# Altium project PCB_Eng_Model_OBDH_2.PrjPcb
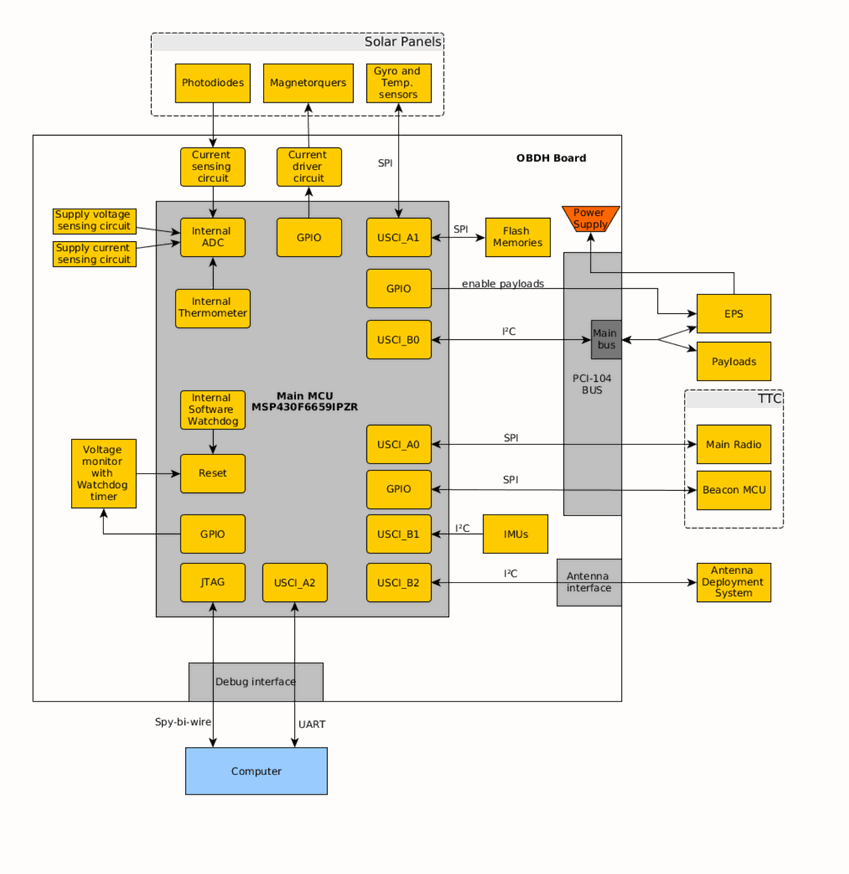
[diagram p0: 0_Architecture.SchDoc]
8 sheets, 189 parts. Net scope: hierarchical (ports join the sheet entries above them; power ports are global).
Board file: PCB_OBDH.PcbDoc
Sheets:
  0_Architecture.SchDoc
  1_Interface.SchDoc
    Designator = 2_Topology.SchDoc
      MCU_OBDH = 3_MCU_Main.SchDoc
      Current Sensing = 7_Current_Sensing.SchDoc
      Non Volatile Memory = 5_Non_Volatile_Memory.SchDoc
      Magnetorquer Drivers = 6_Magnetorquer_Drivers.SchDoc
      IMU = 4_IMU.SchDoc

## Sheet 0_Architecture.SchDoc: OBDH Hardware Archictecture
size A4; DrawnBy: Sara V. Martinez; Engineer: Flight; Revision: V0.0; SheetNumber: 0; SheetTotal: 7

### Notes on the sheet
- Title
- Size:
- Date:
- A4
- Project:
- Time:
- FloripaSat
- Revision:
- Sheet
- of
- UFSC - SpaceLab
- University Campus - Trindade
- Dep. of Electrical Engineering - CTC
- Florianópolis, Santa Catarina, Brazil
- Drawn By:
- Model:
- CEP: 88040 - 900

## Sheet 1_Interface.SchDoc: OBDH Interface
size A3; DrawnBy: Sara V. Martinez; Engineer: Flight; Revision: V0.0; SheetNumber: 1; SheetTotal: 7
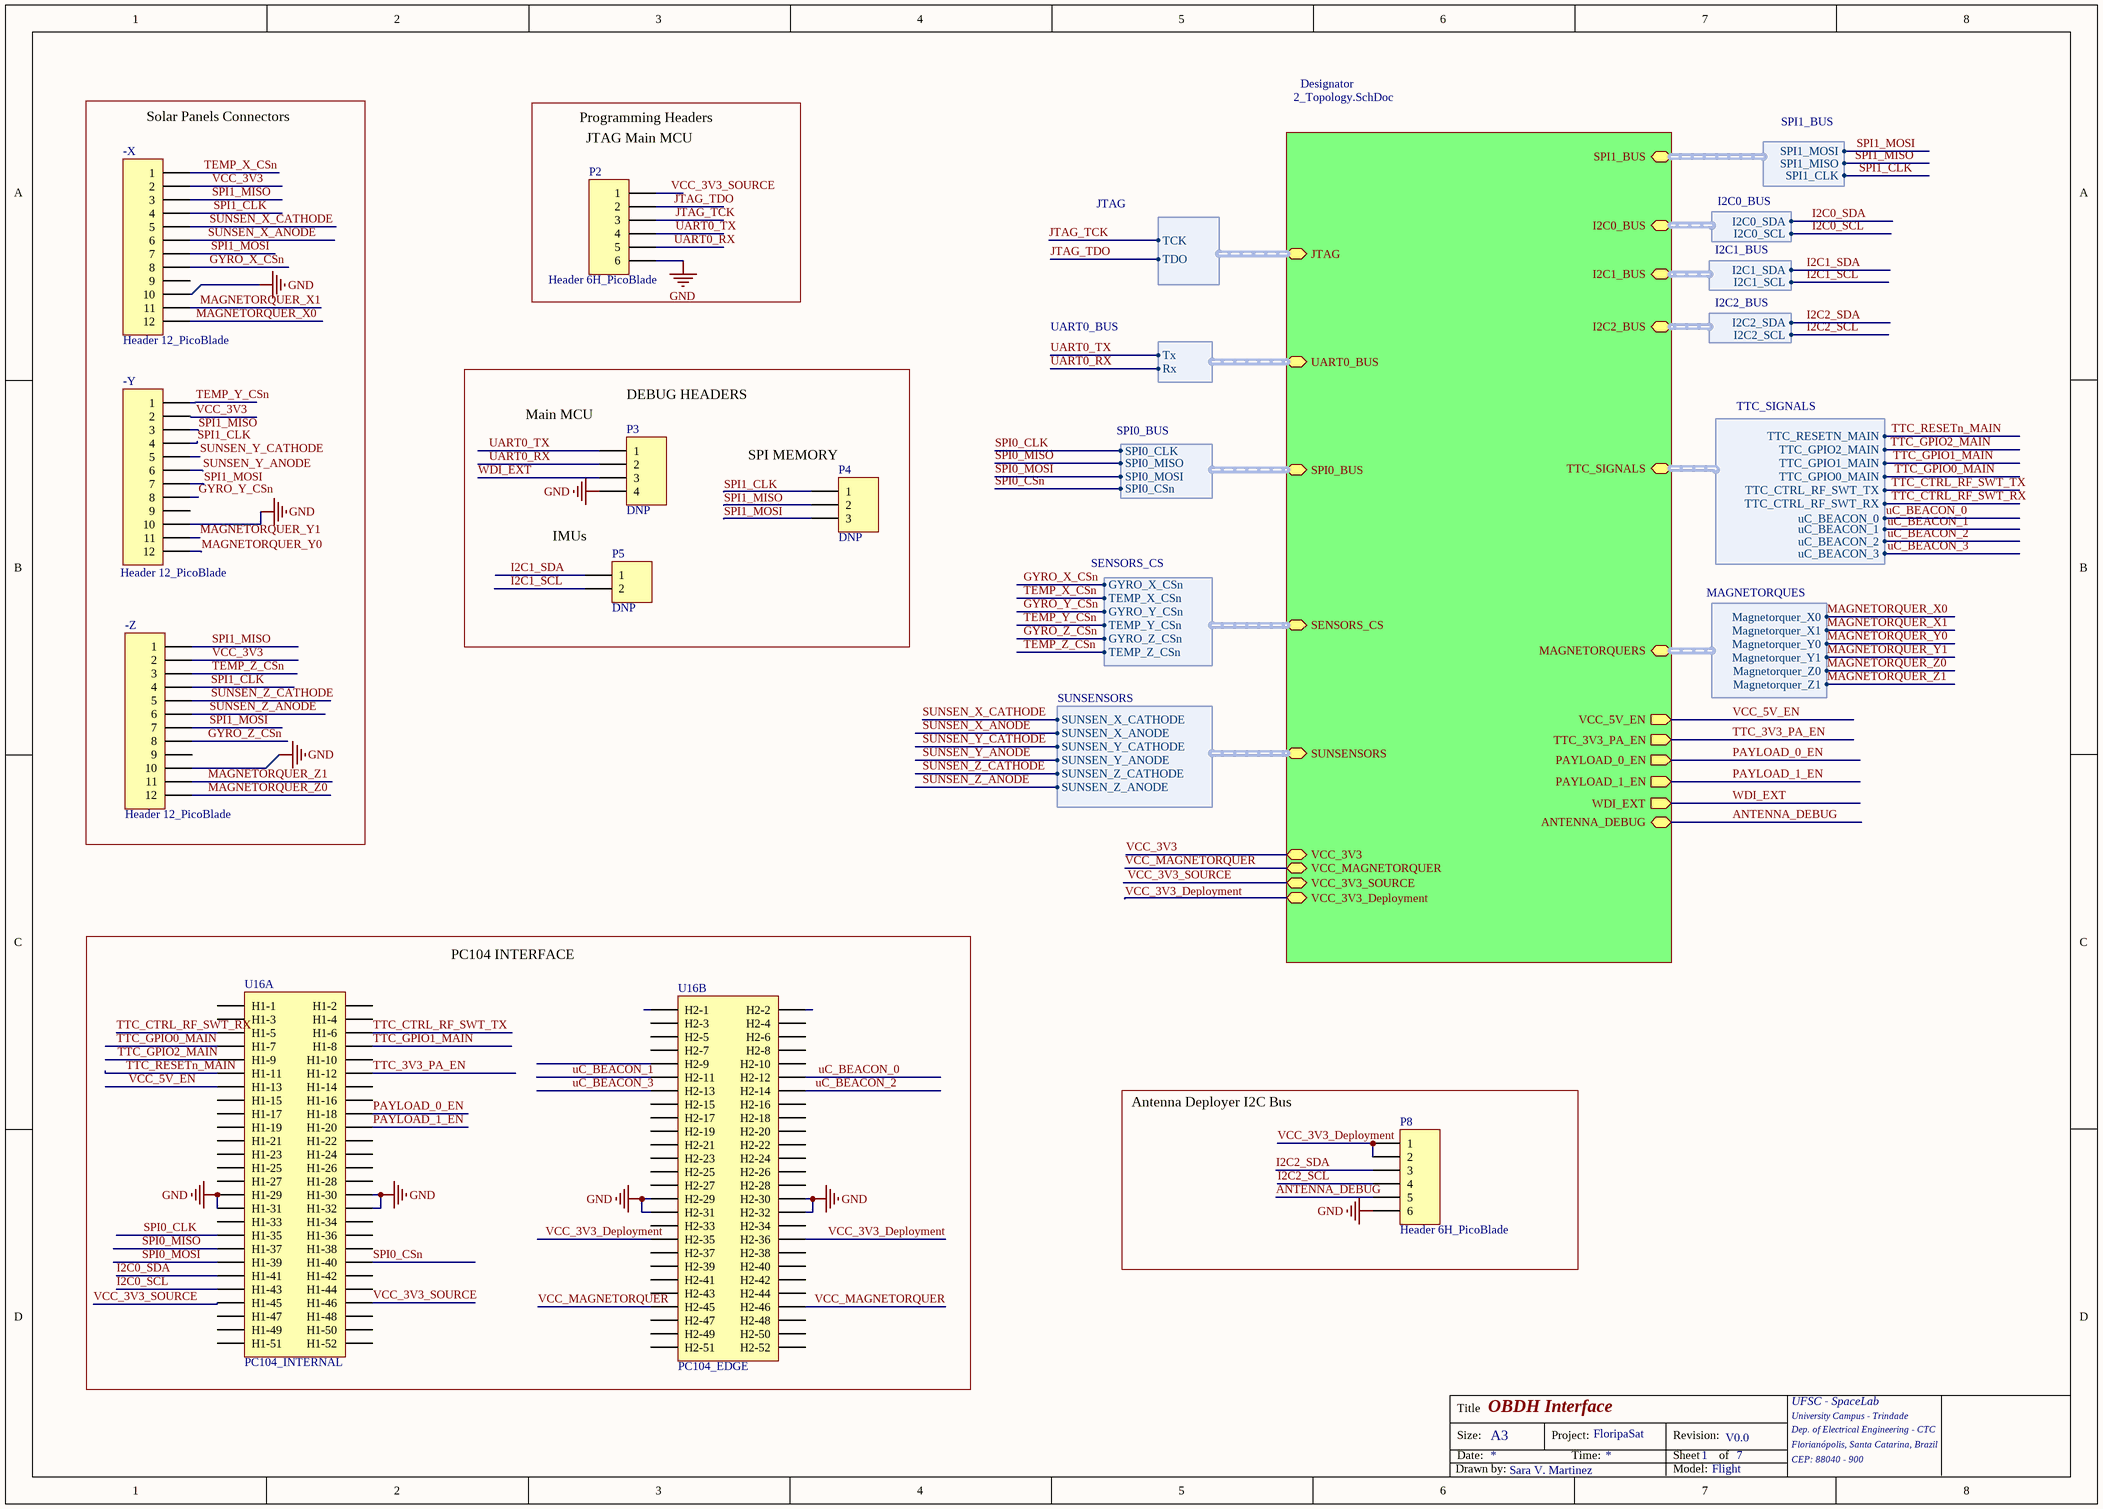
[diagram p1: 1_Interface.SchDoc]

### Parts
-X  Header 12_PicoBlade  [HDR12 PicoBlade - duplicate]
-Y  Header 12_PicoBlade  [HDR12 PicoBlade - duplicate]
-Z  Header 12_PicoBlade  [HDR12 PicoBlade - duplicate]
P2  Header 6H_PicoBlade  [HDR6 PicoBlade]
P3  DNP  [HDR1X4]
P4  DNP  [HDR 1X3]
P5  DNP  [HDR1X2H]
P8  Header 6H_PicoBlade  [HDR6 PicoBlade]
U16  PC104_INTERNAL  [PC104]  (parts A,B of 2)

### Blocks framed on the sheet
Solar Panels Connectors: -X -Y -Z
PC104 INTERFACE: U16
Antenna Deployer I2C Bus: P8

### Sub-sheets
Designator = 2_Topology.SchDoc: JTAG (harness JTAG), VCC_3V3, PAYLOAD_0_EN (out), UART0_BUS (harness UART0_BUS), TTC_3V3_PA_EN (out), SENSORS_CS (harness SENSORS_CS), SUNSENSORS (harness SUNSENSORS), MAGNETORQUERS (harness MAGNETORQUES), VCC_5V_EN (out), VCC_MAGNETORQUER, TTC_SIGNALS (harness TTC_SIGNALS), I2C0_BUS (harness I2C0_BUS), SPI1_BUS (harness SPI1_BUS), I2C1_BUS (harness I2C1_BUS), I2C2_BUS (harness I2C2_BUS), PAYLOAD_1_EN (out), WDI_EXT (out), SPI0_BUS (harness SPI0_BUS), VCC_3V3_SOURCE, ANTENNA_DEBUG, VCC_3V3_Deployment

### Harnesses
JTAG: TDO, TCK
UART0_BUS: Rx, Tx
SENSORS_CS: GYRO_X_CSn, TEMP_X_CSn, GYRO_Y_CSn, TEMP_Y_CSn, GYRO_Z_CSn, TEMP_Z_CSn
SUNSENSORS: SUNSEN_Z_ANODE, SUNSEN_Z_CATHODE, SUNSEN_Y_ANODE, SUNSEN_Y_CATHODE, SUNSEN_X_ANODE, SUNSEN_X_CATHODE
MAGNETORQUES: Magnetorquer_X0, Magnetorquer_X1, Magnetorquer_Y0, Magnetorquer_Y1, Magnetorquer_Z0, Magnetorquer_Z1
I2C0_BUS: I2C0_SDA, I2C0_SCL
I2C1_BUS: I2C1_SDA, I2C1_SCL
I2C2_BUS: I2C2_SDA, I2C2_SCL
SPI0_BUS: SPI0_CLK, SPI0_MISO, SPI0_MOSI, SPI0_CSn
TTC_SIGNALS: TTC_CTRL_RF_SWT_RX, TTC_CTRL_RF_SWT_TX, TTC_GPIO0_MAIN, TTC_GPIO1_MAIN, TTC_GPIO2_MAIN, TTC_RESETN_MAIN, uC_BEACON_0, uC_BEACON_1, uC_BEACON_2, uC_BEACON_3
SPI1_BUS: SPI1_CLK, SPI1_MISO, SPI1_MOSI

### Nets
GND: -X.10 -Y.10 -Z.10 P2.6 P3.4 P8.6 U16.H1-29 U16.H1-30 U16.H1-31 U16.H1-32 U16.H2-29 U16.H2-30 U16.H2-31 U16.H2-32
VCC_3V3: -X.2 -Y.2 -Z.2 ; sheet Designator/VCC_3V3
VCC_3V3_Deployment: P8.1 P8.2 U16.H2-35 U16.H2-36 ; sheet Designator/VCC_3V3_Deployment
ANTENNA_DEBUG: P8.5 ; sheet Designator/ANTENNA_DEBUG
GYRO_X_CSn: -X.8 ; sheet Designator/SENSORS_CS.GYRO_X_CSn
GYRO_Y_CSn: -Y.8 ; sheet Designator/SENSORS_CS.GYRO_Y_CSn
GYRO_Z_CSn: -Z.8 ; sheet Designator/SENSORS_CS.GYRO_Z_CSn
I2C0_SCL: U16.H1-43 ; sheet Designator/I2C0_BUS.I2C0_SCL
I2C0_SDA: U16.H1-41 ; sheet Designator/I2C0_BUS.I2C0_SDA
I2C1_SCL: P5.2 ; sheet Designator/I2C1_BUS.I2C1_SCL
I2C1_SDA: P5.1 ; sheet Designator/I2C1_BUS.I2C1_SDA
I2C2_SCL: P8.4 ; sheet Designator/I2C2_BUS.I2C2_SCL
I2C2_SDA: P8.3 ; sheet Designator/I2C2_BUS.I2C2_SDA
JTAG_TCK: P2.3 ; sheet Designator/JTAG.TCK
JTAG_TDO: P2.2 ; sheet Designator/JTAG.TDO
MAGNETORQUER_X0: -X.12 ; sheet Designator/MAGNETORQUERS.Magnetorquer_X0
MAGNETORQUER_X1: -X.11 ; sheet Designator/MAGNETORQUERS.Magnetorquer_X1
MAGNETORQUER_Y0: -Y.12 ; sheet Designator/MAGNETORQUERS.Magnetorquer_Y0
MAGNETORQUER_Y1: -Y.11 ; sheet Designator/MAGNETORQUERS.Magnetorquer_Y1
MAGNETORQUER_Z0: -Z.12 ; sheet Designator/MAGNETORQUERS.Magnetorquer_Z0
MAGNETORQUER_Z1: -Z.11 ; sheet Designator/MAGNETORQUERS.Magnetorquer_Z1
PAYLOAD_0_EN: U16.H1-18 ; sheet Designator/PAYLOAD_0_EN
PAYLOAD_1_EN: U16.H1-20 ; sheet Designator/PAYLOAD_1_EN
SPI0_CLK: U16.H1-35 ; sheet Designator/SPI0_BUS.SPI0_CLK
SPI0_CSn: U16.H1-40 ; sheet Designator/SPI0_BUS.SPI0_CSn
SPI0_MISO: U16.H1-37 ; sheet Designator/SPI0_BUS.SPI0_MISO
SPI0_MOSI: U16.H1-39 ; sheet Designator/SPI0_BUS.SPI0_MOSI
SPI1_CLK: -X.4 -Y.4 -Z.4 P4.1 ; sheet Designator/SPI1_BUS.SPI1_CLK
SPI1_MISO: -X.3 -Y.3 -Z.1 P4.2 ; sheet Designator/SPI1_BUS.SPI1_MISO
SPI1_MOSI: -X.7 -Y.7 -Z.7 P4.3 ; sheet Designator/SPI1_BUS.SPI1_MOSI
SUNSEN_X_ANODE: -X.6 ; sheet Designator/SUNSENSORS.SUNSEN_X_ANODE
SUNSEN_X_CATHODE: -X.5 ; sheet Designator/SUNSENSORS.SUNSEN_X_CATHODE
SUNSEN_Y_ANODE: -Y.6 ; sheet Designator/SUNSENSORS.SUNSEN_Y_ANODE
SUNSEN_Y_CATHODE: -Y.5 ; sheet Designator/SUNSENSORS.SUNSEN_Y_CATHODE
SUNSEN_Z_ANODE: -Z.6 ; sheet Designator/SUNSENSORS.SUNSEN_Z_ANODE
SUNSEN_Z_CATHODE: -Z.5 ; sheet Designator/SUNSENSORS.SUNSEN_Z_CATHODE
TEMP_X_CSn: -X.1 ; sheet Designator/SENSORS_CS.TEMP_X_CSn
TEMP_Y_CSn: -Y.1 ; sheet Designator/SENSORS_CS.TEMP_Y_CSn
TEMP_Z_CSn: -Z.3 ; sheet Designator/SENSORS_CS.TEMP_Z_CSn
TTC_3V3_PA_EN: U16.H1-12 ; sheet Designator/TTC_3V3_PA_EN
TTC_CTRL_RF_SWT_RX: U16.H1-5 ; sheet Designator/TTC_SIGNALS.TTC_CTRL_RF_SWT_RX
TTC_CTRL_RF_SWT_TX: U16.H1-6 ; sheet Designator/TTC_SIGNALS.TTC_CTRL_RF_SWT_TX
TTC_GPIO0_MAIN: U16.H1-7 ; sheet Designator/TTC_SIGNALS.TTC_GPIO0_MAIN
TTC_GPIO1_MAIN: U16.H1-8 ; sheet Designator/TTC_SIGNALS.TTC_GPIO1_MAIN
TTC_GPIO2_MAIN: U16.H1-9 ; sheet Designator/TTC_SIGNALS.TTC_GPIO2_MAIN
TTC_RESETn_MAIN: U16.H1-11 ; sheet Designator/TTC_SIGNALS.TTC_RESETN_MAIN
UART0_RX: P2.5 P3.2 ; sheet Designator/UART0_BUS.Rx
UART0_TX: P2.4 P3.1 ; sheet Designator/UART0_BUS.Tx
uC_BEACON_0: U16.H2-12 ; sheet Designator/TTC_SIGNALS.uC_BEACON_0
uC_BEACON_1: U16.H2-11 ; sheet Designator/TTC_SIGNALS.uC_BEACON_1
uC_BEACON_2: U16.H2-14 ; sheet Designator/TTC_SIGNALS.uC_BEACON_2
uC_BEACON_3: U16.H2-13 ; sheet Designator/TTC_SIGNALS.uC_BEACON_3
VCC_3V3_SOURCE: P2.1 U16.H1-45 U16.H1-46 ; sheet Designator/VCC_3V3_SOURCE
VCC_5V_EN: U16.H1-13 ; sheet Designator/VCC_5V_EN
VCC_MAGNETORQUER: U16.H2-45 U16.H2-46 ; sheet Designator/VCC_MAGNETORQUER
WDI_EXT: P3.3 ; sheet Designator/WDI_EXT

Not connected (* = marked no-connect by the designer): -X 9; -Y 9; -Z 9; U16 H1-1 H1-2 H1-3 H1-4 H1-10 H1-14 H1-15 H1-16 H1-17 H1-19 H1-21 H1-22 H1-23 H1-24 H1-25 H1-26 H1-27 H1-28 H1-33 H1-34 H1-36 H1-38 H1-42 H1-44 H1-47 H1-48 H1-49 H1-50 H1-51 H1-52 H2-1 H2-2 H2-3 H2-4 H2-5 H2-6 H2-7 H2-8 H2-9 H2-10 H2-15 H2-16 H2-17 H2-18 H2-19 H2-20 H2-21 H2-22 H2-23 H2-24 H2-25 H2-26 H2-27 H2-28 H2-33 H2-34 H2-37 H2-38 H2-39 H2-40 H2-41 H2-42 H2-43 H2-44 H2-47 H2-48 H2-49 H2-50 H2-51 H2-52

### Notes on the sheet
- Programming Headers
- (near P2) JTAG Main MCU
- (near P3) Main MCU
- (near P3) DEBUG HEADERS
- (near P4) SPI MEMORY
- IMUs
- Title
- Size:
- Date:
- A3
- Project:
- Time:
- FloripaSat
- Revision:
- Sheet
- of
- UFSC - SpaceLab
- University Campus - Trindade
- Dep. of Electrical Engineering - CTC
- Florianópolis, Santa Catarina, Brazil
- CEP: 88040 - 900
- Drawn by:
- Model:

### Library data of the parts
-X -Y = Header 12_PicoBlade: Header, 12-Pin; PartNumber: 53398-1271; LatestRevisionDate: 17-Jul-2002; LatestRevisionNote: Re-released for DXP Platform.; Publisher: Altium Limited
-Z = Header 12_PicoBlade: Header, 12-Pin; PartNumber: 533981271; LatestRevisionDate: 17-Jul-2002; LatestRevisionNote: Re-released for DXP Platform.; Publisher: Altium Limited
P2 P8 = Header 6H_PicoBlade: Header, 6-Pin, Right Angle; Partnumber: 53398-0671; LatestRevisionDate: 17-Jul-2002; LatestRevisionNote: Re-released for DXP Platform.; Publisher: Altium Limited
P3 = Header 4: Header, 4-Pin; LatestRevisionDate: 17-Jul-2002; LatestRevisionNote: Re-released for DXP Platform.; Publisher: Altium Limited
P4 = Header 3H: Header, 3-Pin, Right Angle; Partnumber: 4-103327-5; LatestRevisionDate: 17-Jul-2002; LatestRevisionNote: Re-released for DXP Platform.; Publisher: Altium Limited
P5 = Header 2H: Header, 2-Pin, Right Angle; LatestRevisionDate: 17-Jul-2002; LatestRevisionNote: Re-released for DXP Platform.; Publisher: Altium Limited
U16 = PC104: Partnumber: ESQ-126-39-G-D

## Sheet 2_Topology.SchDoc: OBDH Topology
size A3; DrawnBy: Sara V.Martinez; Engineer: Flight; Revision: V0.0; SheetNumber: 2; SheetTotal: 7
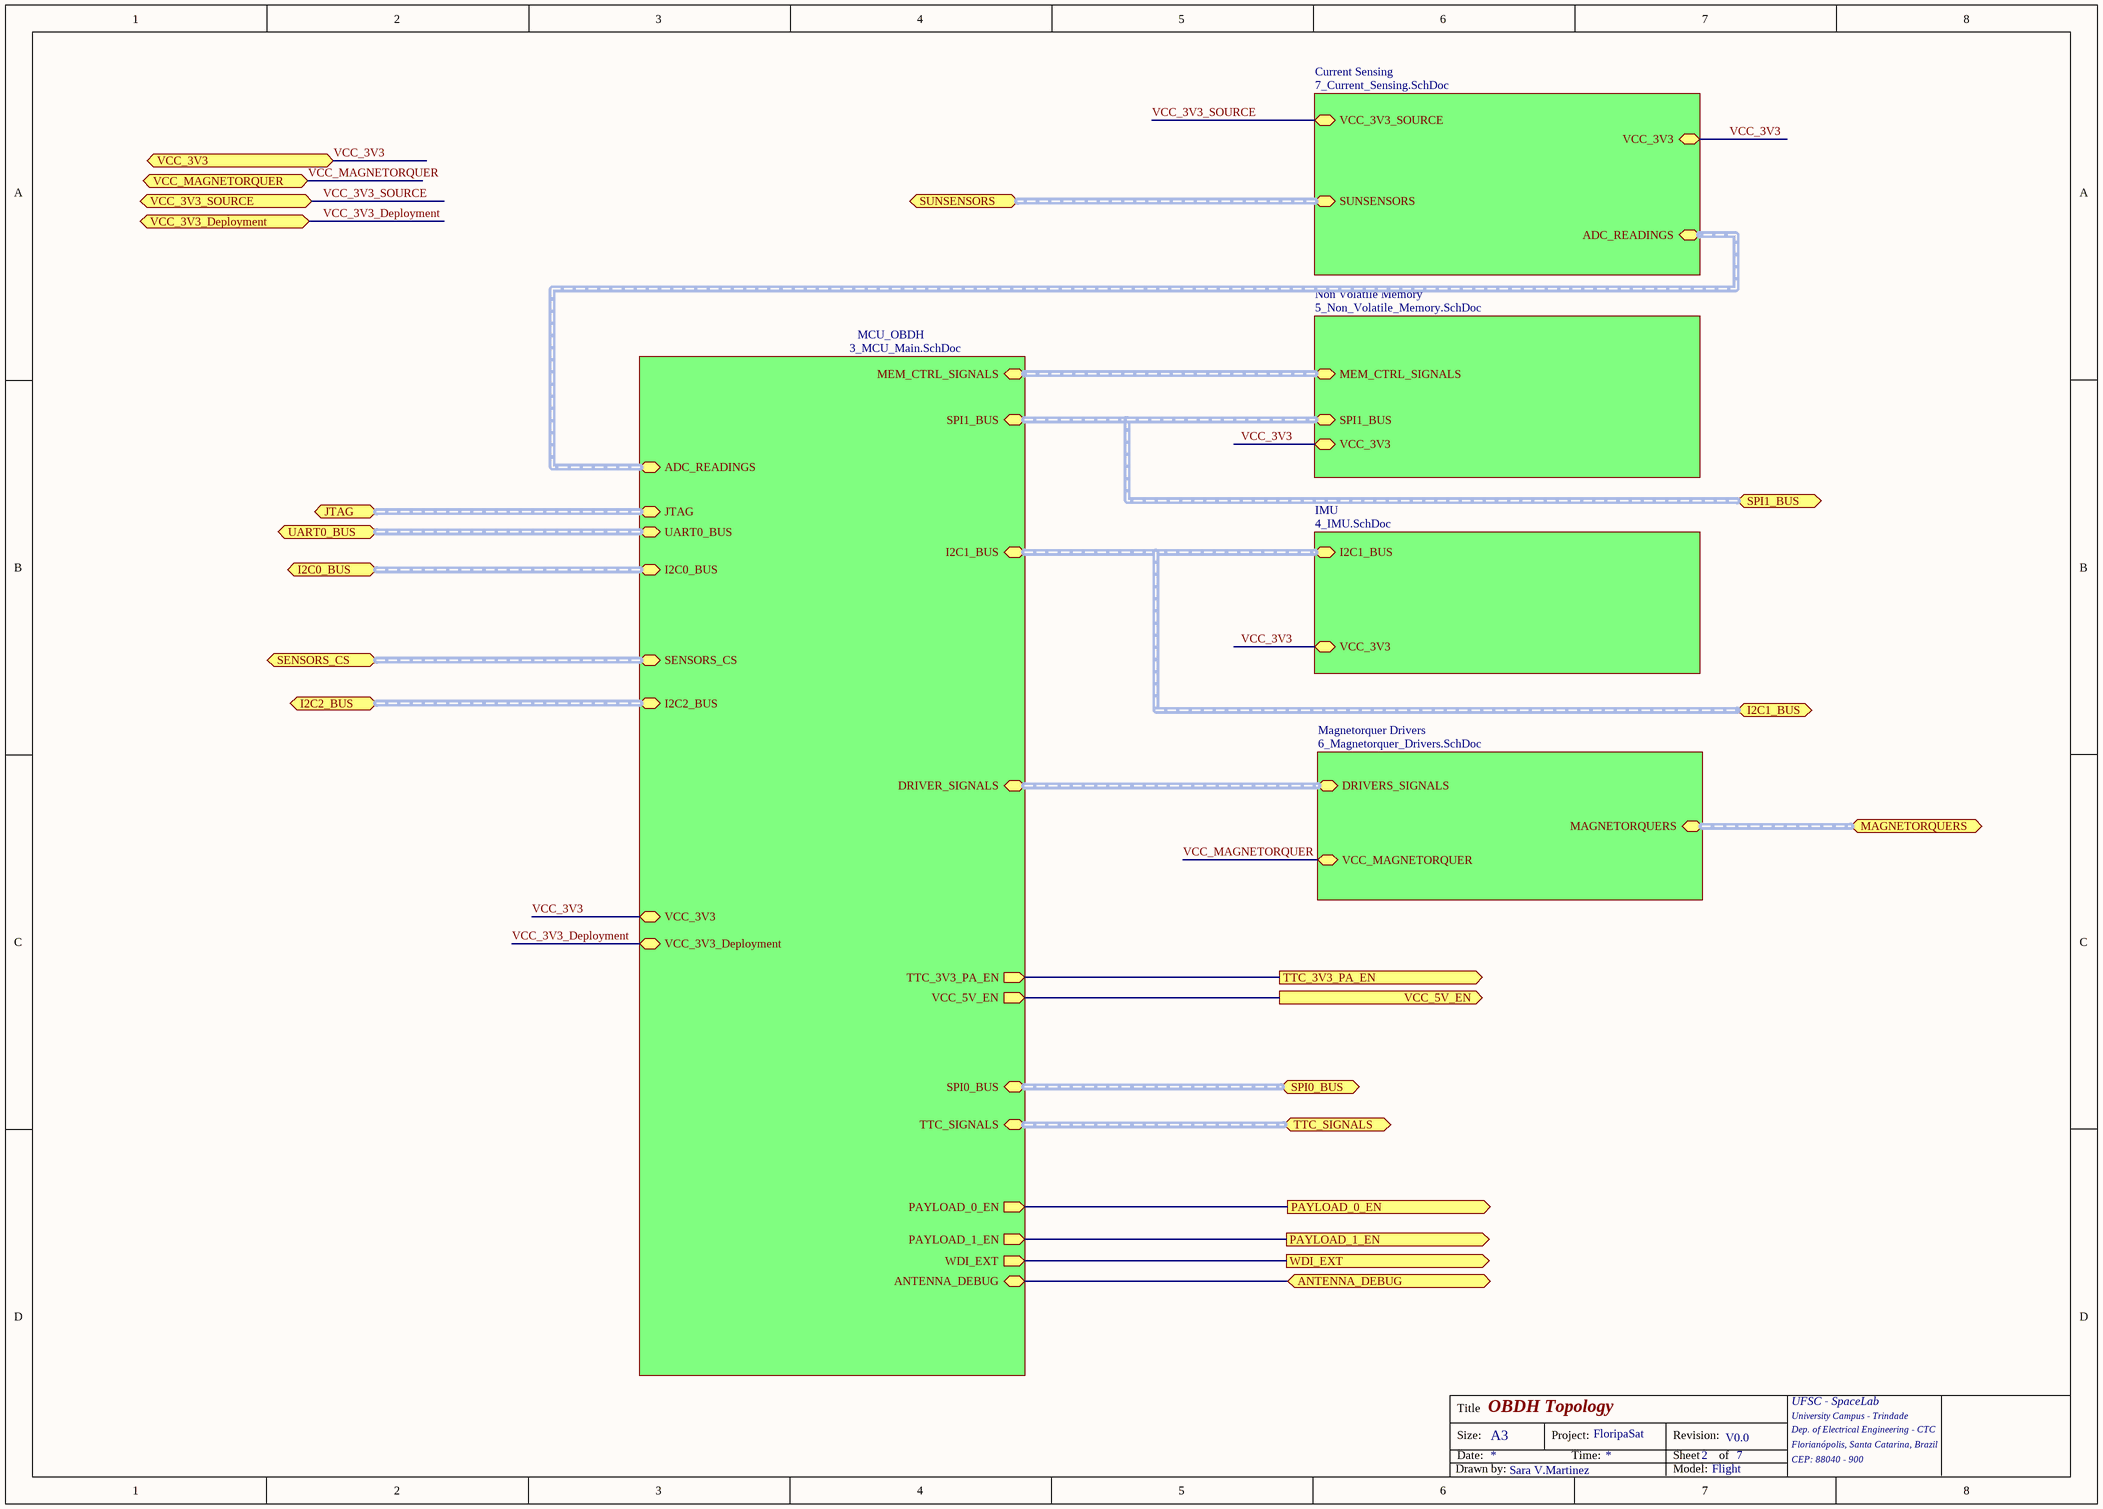
[diagram p2: 2_Topology.SchDoc]

### Sub-sheets
Current Sensing = 7_Current_Sensing.SchDoc: VCC_3V3, SUNSENSORS (harness SUNSENSORS), ADC_READINGS (harness ADC_READINGS), VCC_3V3_SOURCE
IMU = 4_IMU.SchDoc: I2C1_BUS (harness I2C1_BUS), VCC_3V3
Magnetorquer Drivers = 6_Magnetorquer_Drivers.SchDoc: MAGNETORQUERS (harness MAGNETORQUERS), DRIVERS_SIGNALS (harness DRIVER_SIGNALS), VCC_MAGNETORQUER
MCU_OBDH = 3_MCU_Main.SchDoc: JTAG (harness JTAG), UART0_BUS (harness UART0_BUS), VCC_3V3, TTC_3V3_PA_EN (out), SENSORS_CS (harness SENSORS_CS), PAYLOAD_0_EN (out), VCC_5V_EN (out), DRIVER_SIGNALS (harness DRIVER_SIGNALS), I2C1_BUS (harness I2C1_BUS), SPI1_BUS (harness SPI1_BUS), TTC_SIGNALS (harness TTC_SIGNALS), ADC_READINGS (harness ADC_READINGS), PAYLOAD_1_EN (out), MEM_CTRL_SIGNALS (harness MEM_CTRL_SIGNALS), WDI_EXT (out), I2C2_BUS (harness I2C2_BUS), SPI0_BUS (harness SPI0_BUS), I2C0_BUS (harness I2C0_BUS), ANTENNA_DEBUG, VCC_3V3_Deployment
Non Volatile Memory = 5_Non_Volatile_Memory.SchDoc: SPI1_BUS (harness SPI1_BUS), VCC_3V3, MEM_CTRL_SIGNALS (harness MEM_CTRL_SIGNALS)

### Ports
ANTENNA_DEBUG, I2C0_BUS (harness I2C0_BUS), I2C1_BUS (harness I2C1_BUS), I2C2_BUS (harness I2C2_BUS), JTAG (harness JTAG), MAGNETORQUERS (harness MAGNETORQUERS), PAYLOAD_0_EN (out), PAYLOAD_1_EN (out), SENSORS_CS (harness SENSORS_CS), SPI0_BUS (harness SPI0_BUS), SPI1_BUS (harness SPI1_BUS), SUNSENSORS (harness SUNSENSORS), TTC_3V3_PA_EN (out), TTC_SIGNALS (harness TTC_SIGNALS), UART0_BUS (harness UART0_BUS), VCC_3V3, VCC_3V3_Deployment, VCC_3V3_SOURCE, VCC_5V_EN (out), VCC_MAGNETORQUER, WDI_EXT (out)

### Nets
VCC_3V3: port VCC_3V3, sheet MCU_OBDH/VCC_3V3, sheet Current Sensing/VCC_3V3, sheet Non Volatile Memory/VCC_3V3, sheet IMU/VCC_3V3
VCC_3V3_Deployment: port VCC_3V3_Deployment, sheet MCU_OBDH/VCC_3V3_Deployment
ANTENNA_DEBUG: port ANTENNA_DEBUG, sheet MCU_OBDH/ANTENNA_DEBUG
PAYLOAD_0_EN: port PAYLOAD_0_EN, sheet MCU_OBDH/PAYLOAD_0_EN
PAYLOAD_1_EN: port PAYLOAD_1_EN, sheet MCU_OBDH/PAYLOAD_1_EN
TTC_3V3_PA_EN: port TTC_3V3_PA_EN, sheet MCU_OBDH/TTC_3V3_PA_EN
VCC_3V3_SOURCE: port VCC_3V3_SOURCE, sheet Current Sensing/VCC_3V3_SOURCE
VCC_5V_EN: port VCC_5V_EN, sheet MCU_OBDH/VCC_5V_EN
VCC_MAGNETORQUER: port VCC_MAGNETORQUER, sheet Magnetorquer Drivers/VCC_MAGNETORQUER
WDI_EXT: port WDI_EXT, sheet MCU_OBDH/WDI_EXT

### Buses and harness runs
harness port I2C0_BUS = sheet MCU_OBDH/I2C0_BUS
harness port I2C1_BUS = sheet IMU/I2C1_BUS = sheet MCU_OBDH/I2C1_BUS
harness port I2C2_BUS = sheet MCU_OBDH/I2C2_BUS
harness port JTAG = sheet MCU_OBDH/JTAG
harness port MAGNETORQUERS = sheet Magnetorquer Drivers/MAGNETORQUERS
harness port SENSORS_CS = sheet MCU_OBDH/SENSORS_CS
harness port SPI0_BUS = sheet MCU_OBDH/SPI0_BUS
harness port SPI1_BUS = sheet MCU_OBDH/SPI1_BUS = sheet Non Volatile Memory/SPI1_BUS
harness port SUNSENSORS = sheet Current Sensing/SUNSENSORS
harness port TTC_SIGNALS = sheet MCU_OBDH/TTC_SIGNALS
harness port UART0_BUS = sheet MCU_OBDH/UART0_BUS
harness sheet Current Sensing/ADC_READINGS = sheet MCU_OBDH/ADC_READINGS
harness sheet Magnetorquer Drivers/DRIVERS_SIGNALS = sheet MCU_OBDH/DRIVER_SIGNALS
harness sheet MCU_OBDH/MEM_CTRL_SIGNALS = sheet Non Volatile Memory/MEM_CTRL_SIGNALS

### Notes on the sheet
- Title
- Size:
- Date:
- A3
- Project:
- Time:
- FloripaSat
- Revision:
- Sheet
- of
- UFSC - SpaceLab
- University Campus - Trindade
- Dep. of Electrical Engineering - CTC
- Florianópolis, Santa Catarina, Brazil
- CEP: 88040 - 900
- Drawn by:
- Model:

## Sheet 3_MCU_Main.SchDoc: OBDH MCU Main
size A3; DrawnBy: Sara V. Martínez; Revision: V0.0; SheetNumber: 3; SheetTotal: 7
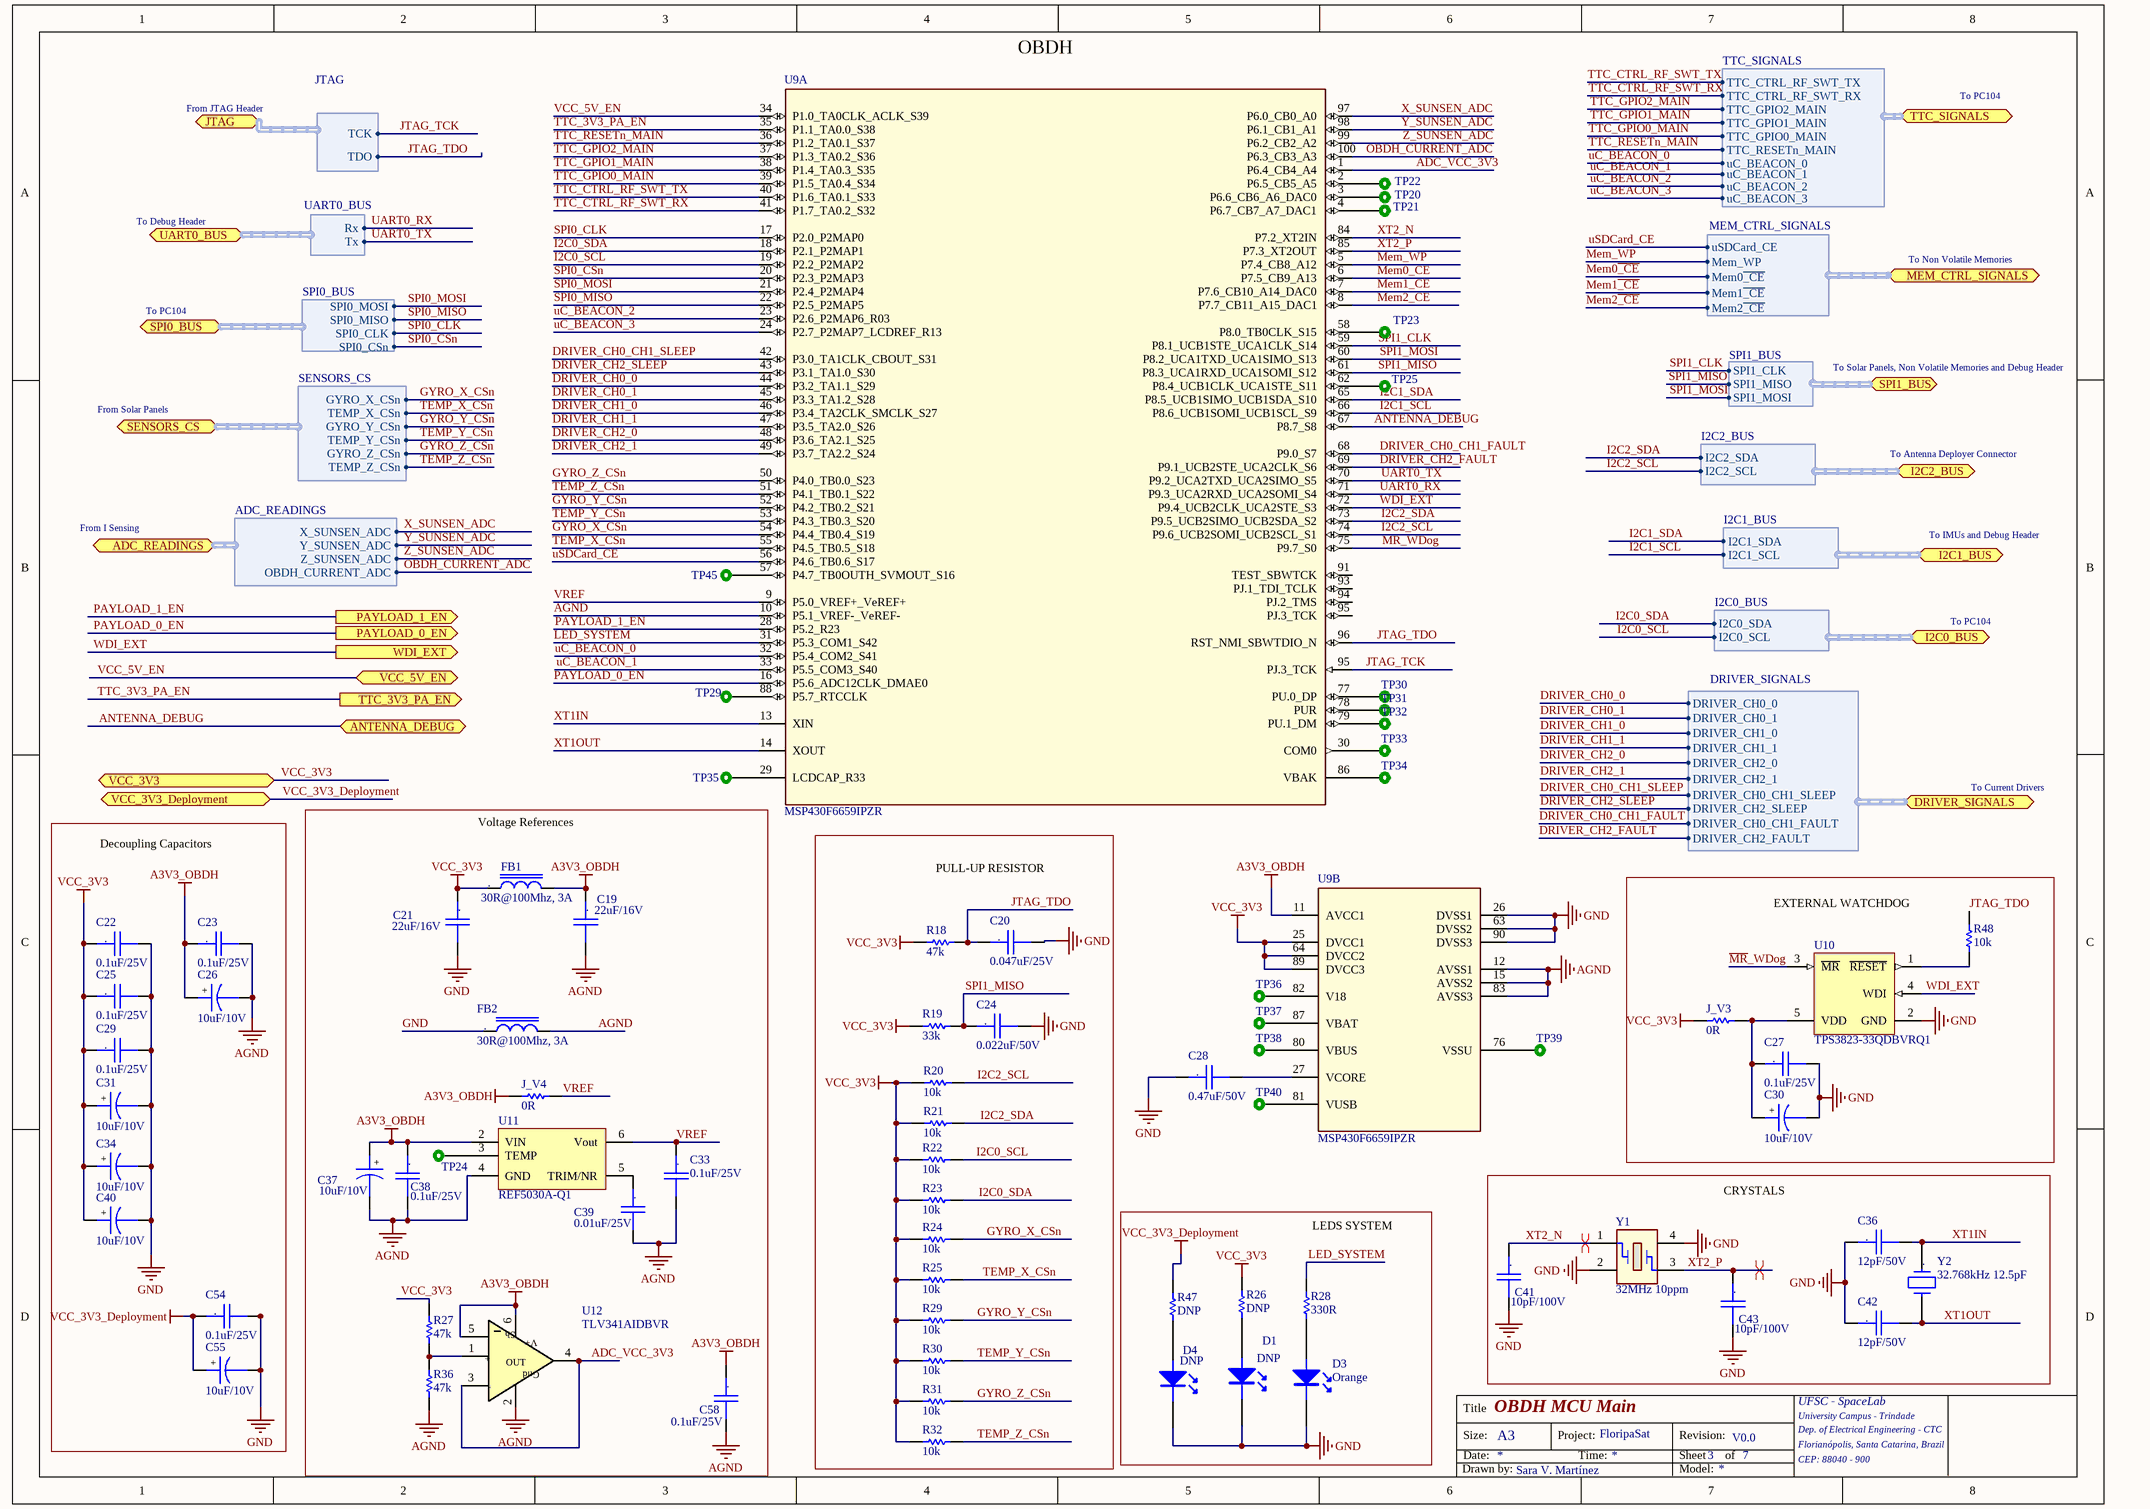
[diagram p3: 3_MCU_Main.SchDoc]

### Parts
C19  22uF/16V  [CC1210]
C20  0.047uF/25V  [CC0805]
C21  22uF/16V  [CC1210]
C22  0.1uF/25V  [CC0805]
C23  0.1uF/25V  [CC0805]
C24  0.022uF/50V  [CC0805]
C25  0.1uF/25V  [CC0805]
C26  10uF/10V  [CC0805_Tantalum]
C27  0.1uF/25V  [CC0805]
C28  0.47uF/50V  [CC0805]
C29  0.1uF/25V  [CC0805]
C30  10uF/10V  [CC0805_Tantalum]
C31  10uF/10V  [CC0805_Tantalum]
C33  0.1uF/25V  [CC0805]
C34  10uF/10V  [CC0805_Tantalum]
C36  12pF/50V  [CC0805]
C37  10uF/10V  [CC0805_Tantalum]
C38  0.1uF/25V  [CC0805]
C39  0.01uF/25V  [CC0805]
C40  10uF/10V  [CC0805_Tantalum]
C41  10pF/100V  [CC0805]
C42  12pF/50V  [CC0805]
C43  10pF/100V  [CC0805]
C54  0.1uF/25V  [CC0805]
C55  10uF/10V  [CC0805_Tantalum]
C58  0.1uF/25V  [CC0805]
D1  DNP  [0805-LED]
D3  Orange  [0805-LED]
D4  DNP  [0805-LED]
FB1  30R@100Mhz, 3A  [IND0805]
FB2  30R@100Mhz, 3A  [IND0805]
J_V3  0R  [0805]
J_V4  0R  [0805]
R18  47k  [0805]
R19  33k  [0805]
R20  10k  [0805]
R21  10k  [0805]
R22  10k  [0805]
R23  10k  [0805]
R24  10k  [0805]
R25  10k  [0805]
R26  DNP  [0805]
R27  47k  [0805]
R28  330R  [0805]
R29  10k  [0805]
R30  10k  [0805]
R31  10k  [0805]
R32  10k  [0805]
R36  47k  [0805]
R47  DNP  [0805]
R48  10k  [0805]
TP20  TEST_POINT_2  [TEST_POINT_2]  (value not drawn)  (no BOM)
TP21  TEST_POINT_2  [TEST_POINT_2]  (value not drawn)  (no BOM)
TP22  TEST_POINT_2  [TEST_POINT_2]  (value not drawn)  (no BOM)
TP23  TEST_POINT_2  [TEST_POINT_2]  (value not drawn)  (no BOM)
TP24  TEST_POINT_2  [TEST_POINT_2]  (value not drawn)  (no BOM)
TP25  TEST_POINT_2  [TEST_POINT_2]  (value not drawn)  (no BOM)
TP29  TEST_POINT_2  [TEST_POINT_2]  (value not drawn)  (no BOM)
TP30  TEST_POINT_2  [TEST_POINT_2]  (value not drawn)  (no BOM)
TP31  TEST_POINT_2  [TEST_POINT_2]  (value not drawn)  (no BOM)
TP32  TEST_POINT_2  [TEST_POINT_2]  (value not drawn)  (no BOM)
TP33  TEST_POINT_2  [TEST_POINT_2]  (value not drawn)  (no BOM)
TP34  TEST_POINT_2  [TEST_POINT_2]  (value not drawn)  (no BOM)
TP35  TEST_POINT_2  [TEST_POINT_2]  (value not drawn)  (no BOM)
TP36  TEST_POINT_2  [TEST_POINT_2]  (value not drawn)  (no BOM)
TP37  TEST_POINT_2  [TEST_POINT_2]  (value not drawn)  (no BOM)
TP38  TEST_POINT_2  [TEST_POINT_2]  (value not drawn)  (no BOM)
TP39  TEST_POINT_2  [TEST_POINT_2]  (value not drawn)  (no BOM)
TP40  TEST_POINT_2  [TEST_POINT_2]  (value not drawn)  (no BOM)
TP45  TEST_POINT_2  [TEST_POINT_2]  (value not drawn)  (no BOM)
U9  MSP430F6659IPZR  [PZ0100A_N]  (parts A,B of 2)
U10  TPS3823-33QDBVRQ1  [DBV0005A_N]
U11  REF5030A-Q1  [SOIC-8]
U12  TLV341AIDBVR  [SOT-23 6L]
Y1  32MHz 10ppm  [XTAL_ABM8X]
Y2  32.768kHz 12.5pF  [ABS06 0805]

### Blocks framed on the sheet
Decoupling Capacitors: C22 C23 C25 C26 C29 C31 C34 C40 C54 C55
Voltage References: C19 C21 C33 C37-C39 C58 FB1 FB2 J_V4 R27 R36 TP24 U11 U12
PULL-UP RESISTOR: C20 C24 R18-R25 R29-R32
EXTERNAL WATCHDOG: C27 C30 J_V3 R48 U10
CRYSTALS: C36 C41-C43 Y1 Y2
LEDS SYSTEM: D1 D3 D4 R26 R28 R47

### Ports
ADC_READINGS (harness ADC_READINGS), ANTENNA_DEBUG, DRIVER_SIGNALS (harness DRIVER_SIGNALS), I2C0_BUS (harness I2C0_BUS), I2C1_BUS (harness I2C1_BUS), I2C2_BUS (harness I2C2_BUS), JTAG (harness JTAG), MEM_CTRL_SIGNALS (harness MEM_CTRL_SIGNALS), PAYLOAD_0_EN (out), PAYLOAD_1_EN (out), SENSORS_CS (harness SENSORS_CS), SPI0_BUS (harness SPI0_BUS), SPI1_BUS (harness SPI1_BUS), TTC_3V3_PA_EN (out), TTC_SIGNALS (harness TTC_SIGNALS), UART0_BUS (harness UART0_BUS), VCC_3V3, VCC_3V3_Deployment, VCC_5V_EN, WDI_EXT (out)

### Harnesses
JTAG: TDO, TCK
UART0_BUS: Rx, Tx
I2C1_BUS: I2C1_SCL, I2C1_SDA
SENSORS_CS: GYRO_X_CSn, TEMP_X_CSn, GYRO_Y_CSn, TEMP_Y_CSn, GYRO_Z_CSn, TEMP_Z_CSn
I2C0_BUS: I2C0_SCL, I2C0_SDA
I2C2_BUS: I2C2_SCL, I2C2_SDA
DRIVER_SIGNALS: DRIVER_CH0_CH1_SLEEP, DRIVER_CH2_SLEEP, DRIVER_CH0_CH1_FAULT, DRIVER_CH2_FAULT, DRIVER_CH2_1, DRIVER_CH2_0, DRIVER_CH1_1, DRIVER_CH1_0, DRIVER_CH0_1, DRIVER_CH0_0
TTC_SIGNALS: TTC_RESETn_MAIN, TTC_GPIO0_MAIN, TTC_GPIO1_MAIN, TTC_GPIO2_MAIN, TTC_CTRL_RF_SWT_RX, TTC_CTRL_RF_SWT_TX, uC_BEACON_0, uC_BEACON_1, uC_BEACON_2, uC_BEACON_3
ADC_READINGS: OBDH_CURRENT_ADC, Z_SUNSEN_ADC, Y_SUNSEN_ADC, X_SUNSEN_ADC
MEM_CTRL_SIGNALS: Mem2~{_CE}, Mem1~{_CE}, Mem0~{_CE}, Mem_WP, uSDCard_CE
SPI0_BUS: SPI0_CLK, SPI0_MISO, SPI0_MOSI, SPI0_CSn
SPI1_BUS: SPI1_CLK, SPI1_MISO, SPI1_MOSI

### Nets
A3V3_OBDH: C19.1 C23.1 C26.1 C37.1 C38.1 C58.1 FB1.2 J_V4.2 U9.11(AVCC1) U11.2(VIN) U12.5(EN) U12.6(V+)
AGND: C19.2 C23.2 C26.2 C33.2 C37.2 C38.2 C39.2 C58.2 FB2.2 R36.2 U9.10(P5.1_VREF-_VeREF-) U9.12(AVSS1) U9.15(AVSS2) U9.83(AVSS3) U11.4(GND) U12.2(Gnd)
GND: C20.2 C21.2 C22.2 C24.2 C25.2 C27.2 C28.1 C29.2 C30.2 C31.2 C34.2 C36.1 C40.2 C41.2 C42.1 C43.2 C54.2 C55.2 D1.2(K) D3.2(K) D4.2(K) FB2.1 U9.26(DVSS1) U9.63(DVSS2) U9.90(DVSS3) U10.2(GND) Y1.2 Y1.4
VCC_3V3: C21.1 C22.1 C25.1 C29.1 C31.1 C34.1 C40.1 FB1.1 J_V3.2 R18.2 R19.2 R20.2 R21.2 R22.2 R23.2 R24.2 R25.2 R26.2 R27.1 R29.2 R30.2 R31.2 R32.2 U9.25(DVCC1) U9.64(DVCC2) U9.89(DVCC3) ; port VCC_3V3
VCC_3V3_Deployment: C54.1 C55.1 R47.2 ; port VCC_3V3_Deployment
~{MR}_WDog: U9.75(P9.7_S0) U10.3(~{MR})
ADC_VCC_3V3: U9.1(P6.4_CB4_A4) U12.3(-IN) U12.4(OUT)
ANTENNA_DEBUG: U9.67(P8.7_S8) ; port ANTENNA_DEBUG
DRIVER_CH0_0: U9.44(P3.2_TA1.1_S29) ; port DRIVER_SIGNALS.DRIVER_CH0_0
DRIVER_CH0_1: U9.45(P3.3_TA1.2_S28) ; port DRIVER_SIGNALS.DRIVER_CH0_1
DRIVER_CH0_CH1_FAULT: U9.68(P9.0_S7) ; port DRIVER_SIGNALS.DRIVER_CH0_CH1_FAULT
DRIVER_CH0_CH1_SLEEP: U9.42(P3.0_TA1CLK_CBOUT_S31) ; port DRIVER_SIGNALS.DRIVER_CH0_CH1_SLEEP
DRIVER_CH1_0: U9.46(P3.4_TA2CLK_SMCLK_S27) ; port DRIVER_SIGNALS.DRIVER_CH1_0
DRIVER_CH1_1: U9.47(P3.5_TA2.0_S26) ; port DRIVER_SIGNALS.DRIVER_CH1_1
DRIVER_CH2_0: U9.48(P3.6_TA2.1_S25) ; port DRIVER_SIGNALS.DRIVER_CH2_0
DRIVER_CH2_1: U9.49(P3.7_TA2.2_S24) ; port DRIVER_SIGNALS.DRIVER_CH2_1
DRIVER_CH2_FAULT: U9.69(P9.1_UCB2STE_UCA2CLK_S6) ; port DRIVER_SIGNALS.DRIVER_CH2_FAULT
DRIVER_CH2_SLEEP: U9.43(P3.1_TA1.0_S30) ; port DRIVER_SIGNALS.DRIVER_CH2_SLEEP
GYRO_X_CSn: R24.1 U9.54(P4.4_TB0.4_S19) ; port SENSORS_CS.GYRO_X_CSn
GYRO_Y_CSn: R29.1 U9.52(P4.2_TB0.2_S21) ; port SENSORS_CS.GYRO_Y_CSn
GYRO_Z_CSn: R31.1 U9.50(P4.0_TB0.0_S23) ; port SENSORS_CS.GYRO_Z_CSn
I2C0_SCL: R22.1 U9.19(P2.2_P2MAP2) ; port I2C0_BUS.I2C0_SCL
I2C0_SDA: R23.1 U9.18(P2.1_P2MAP1) ; port I2C0_BUS.I2C0_SDA
I2C1_SCL: U9.66(P8.6_UCB1SOMI_UCB1SCL_S9) ; port I2C1_BUS.I2C1_SCL
I2C1_SDA: U9.65(P8.5_UCB1SIMO_UCB1SDA_S10) ; port I2C1_BUS.I2C1_SDA
I2C2_SCL: R20.1 U9.74(P9.6_UCB2SOMI_UCB2SCL_S1) ; port I2C2_BUS.I2C2_SCL
I2C2_SDA: R21.1 U9.73(P9.5_UCB2SIMO_UCB2SDA_S2) ; port I2C2_BUS.I2C2_SDA
JTAG_TCK: U9.95(PJ.3_TCK) ; port JTAG.TCK
JTAG_TDO: C20.1 R18.1 R48.1 U9.96(RST_NMI_SBWTDIO_N) ; port JTAG.TDO
LED_SYSTEM: R28.1 U9.31(P5.3_COM1_S42)
Mem0~{_CE}: U9.6(P7.5_CB9_A13) ; port MEM_CTRL_SIGNALS.Mem0~{_CE}
Mem1~{_CE}: U9.7(P7.6_CB10_A14_DAC0) ; port MEM_CTRL_SIGNALS.Mem1~{_CE}
Mem2~{_CE}: U9.8(P7.7_CB11_A15_DAC1) ; port MEM_CTRL_SIGNALS.Mem2~{_CE}
Mem_WP: U9.5(P7.4_CB8_A12) ; port MEM_CTRL_SIGNALS.Mem_WP
OBDH_CURRENT_ADC: U9.100(P6.3_CB3_A3) ; port ADC_READINGS.OBDH_CURRENT_ADC
PAYLOAD_0_EN: U9.16(P5.6_ADC12CLK_DMAE0) ; port PAYLOAD_0_EN
PAYLOAD_1_EN: U9.28(P5.2_R23) ; port PAYLOAD_1_EN
SPI0_CLK: U9.17(P2.0_P2MAP0) ; port SPI0_BUS.SPI0_CLK
SPI0_CSn: U9.20(P2.3_P2MAP3) ; port SPI0_BUS.SPI0_CSn
SPI0_MISO: U9.22(P2.5_P2MAP5) ; port SPI0_BUS.SPI0_MISO
SPI0_MOSI: U9.21(P2.4_P2MAP4) ; port SPI0_BUS.SPI0_MOSI
SPI1_CLK: U9.59(P8.1_UCB1STE_UCA1CLK_S14) ; port SPI1_BUS.SPI1_CLK
SPI1_MISO: C24.1 R19.1 U9.61(P8.3_UCA1RXD_UCA1SOMI_S12) ; port SPI1_BUS.SPI1_MISO
SPI1_MOSI: U9.60(P8.2_UCA1TXD_UCA1SIMO_S13) ; port SPI1_BUS.SPI1_MOSI
TEMP_X_CSn: R25.1 U9.55(P4.5_TB0.5_S18) ; port SENSORS_CS.TEMP_X_CSn
TEMP_Y_CSn: R30.1 U9.53(P4.3_TB0.3_S20) ; port SENSORS_CS.TEMP_Y_CSn
TEMP_Z_CSn: R32.1 U9.51(P4.1_TB0.1_S22) ; port SENSORS_CS.TEMP_Z_CSn
TTC_3V3_PA_EN: U9.35(P1.1_TA0.0_S38) ; port TTC_3V3_PA_EN
TTC_CTRL_RF_SWT_RX: U9.41(P1.7_TA0.2_S32) ; port TTC_SIGNALS.TTC_CTRL_RF_SWT_RX
TTC_CTRL_RF_SWT_TX: U9.40(P1.6_TA0.1_S33) ; port TTC_SIGNALS.TTC_CTRL_RF_SWT_TX
TTC_GPIO0_MAIN: U9.39(P1.5_TA0.4_S34) ; port TTC_SIGNALS.TTC_GPIO0_MAIN
TTC_GPIO1_MAIN: U9.38(P1.4_TA0.3_S35) ; port TTC_SIGNALS.TTC_GPIO1_MAIN
TTC_GPIO2_MAIN: U9.37(P1.3_TA0.2_S36) ; port TTC_SIGNALS.TTC_GPIO2_MAIN
TTC_RESETn_MAIN: U9.36(P1.2_TA0.1_S37) ; port TTC_SIGNALS.TTC_RESETn_MAIN
UART0_RX: U9.71(P9.3_UCA2RXD_UCA2SOMI_S4) ; port UART0_BUS.Rx
UART0_TX: U9.70(P9.2_UCA2TXD_UCA2SIMO_S5) ; port UART0_BUS.Tx
uC_BEACON_0: U9.32(P5.4_COM2_S41) ; port TTC_SIGNALS.uC_BEACON_0
uC_BEACON_1: U9.33(P5.5_COM3_S40) ; port TTC_SIGNALS.uC_BEACON_1
uC_BEACON_2: U9.23(P2.6_P2MAP6_R03) ; port TTC_SIGNALS.uC_BEACON_2
uC_BEACON_3: U9.24(P2.7_P2MAP7_LCDREF_R13) ; port TTC_SIGNALS.uC_BEACON_3
uSDCard_CE: U9.56(P4.6_TB0.6_S17) ; port MEM_CTRL_SIGNALS.uSDCard_CE
VCC_5V_EN: U9.34(P1.0_TA0CLK_ACLK_S39) ; port VCC_5V_EN
VREF: C33.1 J_V4.1 U9.9(P5.0_VREF+_VeREF+) U11.6(Vout)
WDI_EXT: U9.72(P9.4_UCB2CLK_UCA2STE_S3) U10.4(WDI) ; port WDI_EXT
X_SUNSEN_ADC: U9.97(P6.0_CB0_A0) ; port ADC_READINGS.X_SUNSEN_ADC
XT1IN: C36.2 U9.13(XIN) Y2.1
XT1OUT: C42.2 U9.14(XOUT) Y2.2
XT2_N: C41.1 U9.84(P7.2_XT2IN) Y1.1
XT2_P: C43.1 U9.85(P7.3_XT2OUT) Y1.3
Y_SUNSEN_ADC: U9.98(P6.1_CB1_A1) ; port ADC_READINGS.Y_SUNSEN_ADC
Z_SUNSEN_ADC: U9.99(P6.2_CB2_A2) ; port ADC_READINGS.Z_SUNSEN_ADC
NetC27_1: C27.1 C30.1 J_V3.1 U10.5(VDD)
NetC28_2: C28.2 U9.27(VCORE)
NetC39_1: C39.1 U11.5(TRIM/NR)
NetD1_1: D1.1(A) R26.1
NetD3_1: D3.1(A) R28.2
NetD4_1: D4.1(A) R47.1
NetR27_2: R27.2 R36.1 U12.1(+IN)
NetR48_2: R48.2 U10.1(~{RESET})
NetTP20_1: TP20.1 U9.3(P6.6_CB6_A6_DAC0)
NetTP21_1: TP21.1 U9.4(P6.7_CB7_A7_DAC1)
NetTP22_1: TP22.1 U9.2(P6.5_CB5_A5)
NetTP23_1: TP23.1 U9.58(P8.0_TB0CLK_S15)
NetTP24_1: TP24.1 U11.3(TEMP)
NetTP25_1: TP25.1 U9.62(P8.4_UCB1CLK_UCA1STE_S11)
NetTP29_1: TP29.1 U9.88(P5.7_RTCCLK)
NetTP30_1: TP30.1 U9.77(PU.0_DP)
NetTP31_1: TP31.1 U9.78(PUR)
NetTP32_1: TP32.1 U9.79(PU.1_DM)
NetTP33_1: TP33.1 U9.30(COM0)
NetTP34_1: TP34.1 U9.86(VBAK)
NetTP35_1: TP35.1 U9.29(LCDCAP_R33)
NetTP36_1: TP36.1 U9.82(V18)
NetTP37_1: TP37.1 U9.87(VBAT)
NetTP38_1: TP38.1 U9.80(VBUS)
NetTP39_1: TP39.1 U9.76(VSSU)
NetTP40_1: TP40.1 U9.81(VUSB)
NetTP45_1: TP45.1 U9.57(P4.7_TB0OUTH_SVMOUT_S16)

Not connected (* = marked no-connect by the designer): U9 91(TEST_SBWTCK) 93(PJ.1_TDI_TCLK) 94(PJ.2_TMS)

### Layout directives
differential pair: XT2_N, XT2_P

### Notes on the sheet
- From JTAG Header
- OBDH
- To PC104
- To Debug Header
- To Non Volatile Memories
- To Solar Panels, Non Volatile Memories and Debug Header
- From Solar Panels
- To Antenna Deployer Connector
- From I Sensing
- To IMUs and Debug Header
- To Current Drivers
- Title
- Size:
- Date:
- A3
- Project:
- Time:
- FloripaSat
- Revision:
- Sheet
- of
- UFSC - SpaceLab
- University Campus - Trindade
- Dep. of Electrical Engineering - CTC
- Florianópolis, Santa Catarina, Brazil
- CEP: 88040 - 900
- Drawn by:
- Model:
- (in symbol Cap_Cer_X7R_0.01uF_16V_1210) .
- (in symbol Cap_Cer_X7R_0.1uF_25V_0805) .
- (in symbol Cap_Cer_X7R_0.01uF_50V_0805) .
- (in symbol Cap_Cer_X7R_0.022uF_50V_0805) .
- (in symbol Cap_Cer_X7R_0.047uF_25V_0603) .
- (in symbol Cap_Cer_X7R_0.47uF_50V_0805) .
- (in symbol Cap_Cer_X7R_10pF_100V_0805) .
- (in symbol Cap_Cer_X7R_12pF_50V_0805) .
- (in symbol Cap_Tant_SMD_10uF_6V3_0805) +
- (in symbol FB_30R_3A_100MHz_0805) .
- (in symbol TLV341AIDBVR) Sh; +; -
- (in symbol Xtal_32.768kHz_12pF_2_SMD) .

### Library data of the parts
C19 C21 = Cap_Cer_X7R_0.01uF_16V_1210: CAP CER 22uF 16V 10% X7R 1210; Partnumber: C3225X7R1C226K250AC; NCM: 8532.24.10
C20 = Cap_Cer_X7R_0.047uF_25V_0603: CAP CER 0.047UF 25V 0603; Partnumber: GCM188R71E473KA37D; NCM: 8532.24.10
C22 C23 C25 C27 C29 C33 C38 C54 C58 = Cap_Cer_X7R_0.1uF_25V_0805: CAP CER 0.1UF 25V 10% X7R 0805; Partnumber: CC0805KRX7R8BB104; NCM: 8532.24.10
C24 = Cap_Cer_X7R_0.022uF_50V_0805: CAP CER 0.022UF 50V 5% X7R 0805; Partnumber: CGA4J2C0G1H223J125AA; NCM: 8532.24.10
C26 C30 C31 C34 C37 C40 C55 = Cap_Tant_SMD_10uF_6V3_0805: CAP Tantalum 10uF 6.3V 10% 0805; Partnumber: TPSR106K006R1000; NCM: 8532.21.11
C28 = Cap_Cer_X7R_0.47uF_50V_0805: CAP CER 0.47UF 50V 10% X7R 0805; Partnumber: C0805C474K5RACTU; NCM: 8532.24.10
C36 C42 = Cap_Cer_X7R_12pF_50V_0805: CAP CER 12pF 50V 0805; Partnumber: CL21C120FBANNNC; NCM: 8532.24.10
C39 = Cap_Cer_X7R_0.01uF_50V_0805: CAP CER 0.01uF 25V 10% X7R 0805; Partnumber: CL21B103KAANNNC; NCM: 8532.24.10
C41 C43 = Cap_Cer_X7R_10pF_100V_0805: CAP CER 10pF 100V 0805; Partnumber: 08051A100FAT2A; NCM: 8532.24.10
D1 D4 = LED/G_0805: SMD Green LED; Partnumber: LTST-C171GKT; NCM: 8541.40.21
D3 = LED/R_0603: SMD Orange LED; Partnumber: LTST-C170KFKT; NCM: 8541.40.21
FB1 FB2 = FB_30R_3A_100MHz_0805: Ferrite Bead 30 OHM 3A 100MHz; Partnumber: BLM21PG300SN1D; NCM: 8504.50.00
J_V3 J_V4 = R0R_JUMPER_1/16W_0805: RES 0R OHM 1/16W JUMPER 0805; Partnumber: CRCW08050000Z0EA; NCM: 8533.21.20
R18 R27 R36 = R27_5%_1/10W_0805: RES 47k OHM 1/10W 1% 0805; Partnumber: RC0805FR-0747KL; NCM: 8533.21.20
R19 = R33k_1%_1/10W_0805: RES 33K OHM 1/10W 1% 0805; Partnumber: RC0805FR-0733KL; NCM: 8533.21.20
R20-R25 R29-R32 R48 = R10k_1%_1/8W_0805: RES 10K OHM 1/8W 1%  0805; Partnumber: CRCW080510K0FKEA; NCM: 8533.21.20
R26 R47 = R1.0k_1%_1/8W_0805: RES 1.0K OHM 1/8W 1% 0805; Partnumber: RC0805FR-071KL; NCM: 8533.21.20
R28 = R330R_1%_1/4W_0805: RES 330R OHM 1/4W 1% 0805; Partnumber: RC0805FR-07330RL; NCM: 8533.21.20
TP20-TP25 TP29-TP40 TP45 = TEST_POINT_2: Test point
U9 = MSP430F6659IPZR: Imported; Manufacturer: Texas Instruments; CompType: IC; PIN_COUNT: 100; Application_BuildNumber: *; PartNumber: MSP430F6659IPZR; Alternate PartNumber: MSP430F6659IPZ; PackageReference: PZ0100A; MountType: SMT; RoHS: Y; RefDes: RefDes; Type: DEV; Value: Value
U10 = CMP-0338-00011-2: Processor Supervisory Circuit, 1 Supply Monitored, -40 to 85 degC, 5-Pin SOT-23 (DBV), Green (RoHS & no Sb/Br); Manufacturer: Texas Instruments; Iq: 15 uA Typ.; Threshold Voltage: 2.93 V Typ.; Watchdog Timer WDI: 0.2 s; VCC: 1.1 V Min.; Reset Threshold Accuracy: 2.4%; Rating: Catalog; Time Delay: 25 ms; # of Supplies Monitored: 1; Output Driver Type / Reset Output: Active-low, Push-pull; Packing: Tape and Reel; ComponentLink1Description: Manufacturer URL; RoHS: TRUE; PackageDescription: 5-Pin Plastic Small Outline, Body 1.6 x 2.9 mm, Pitch 0.95 mm; Mounting Technology: Surface Mount; ComponentLink1URL: www.ti.com; PackageReference: DBV0005A; ComponentLink3URL: http://www.ti.com/lit/ml/mpds018j/mpds018j.pdf; ComponentLink3Description: Package Specification; PartNumber: TPS3823-33QDBVRQ1; DatasheetVersion: SLVS165J; ComponentLink2Description: Datasheet; PackageVersion: 4073253-4/L; ComponentLink2URL: http://www.ti.com/lit/ds/symlink/tps3820-33.pdf; Operating Temperature Range: -40 to 85 degC
Y1 = XTAL_32MHz_SMD_4-SMD: 32MHz ±10ppm Crystal 10pF 60 Ohm -40°C ~ 125°C; Partnumber: ABM8X-102-32.000MHZ-T; NCM: 8541.60.10
Y2 = Xtal_32.768kHz_12pF_2_SMD: 32.768kHz ±20ppm Crystal 12.5pF 70 kOhm -40°C ~ 125°C; Partnumber: ECS-.327-12.5-34S-TR; NCM: 8541.60.10
U11 = REF5030A-Q1: Partnumber: REF5030A-Q1
U12 = TLV341AIDBVR: Partnumber: TLV341AIDBVR

## Sheet 7_Current_Sensing.SchDoc: Current Sensing
size A4; DrawnBy: Sara V. Martinez; Engineer: Flight; Revision: V0.0; SheetNumber: 7; SheetTotal: 7
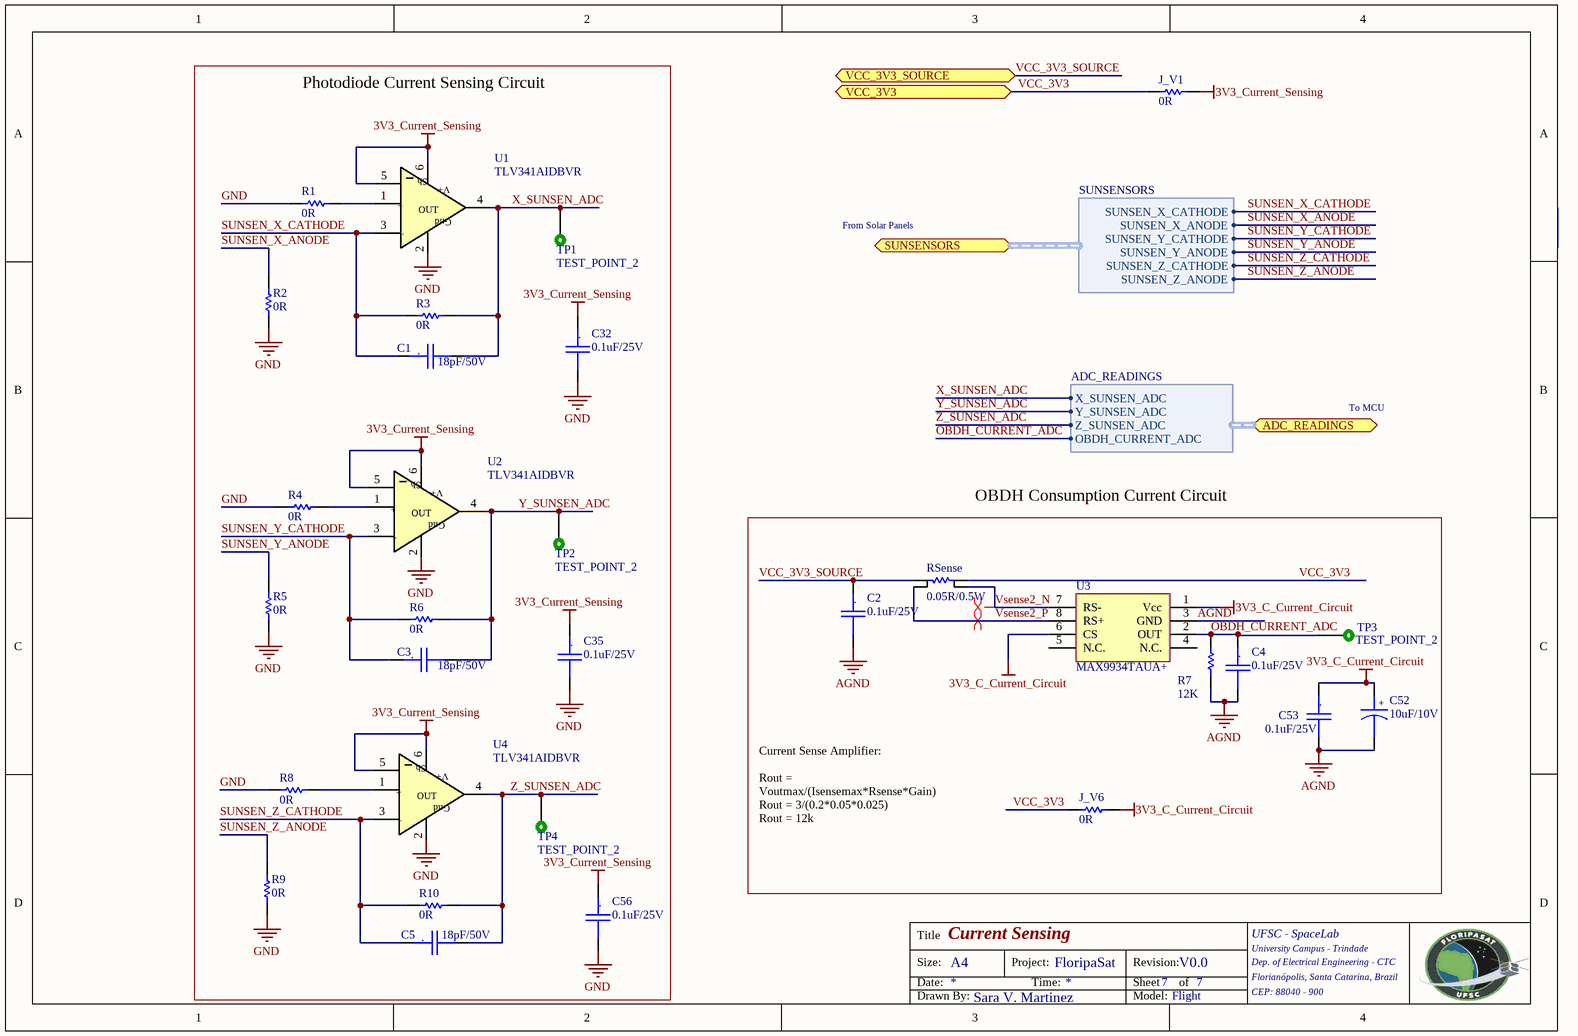
[diagram p4: 7_Current_Sensing.SchDoc]

### Parts
C1  18pF/50V  [CC0805]
C2  0.1uF/25V  [CC0805]
C3  18pF/50V  [CC0805]
C4  0.1uF/25V  [CC0805]
C5  18pF/50V  [CC0805]
C32  0.1uF/25V  [CC0805]
C35  0.1uF/25V  [CC0805]
C52  10uF/10V  [CC0805_Tantalum]
C53  0.1uF/25V  [CC0805]
C56  0.1uF/25V  [CC0805]
J_V1  0R  [0805]
J_V6  0R  [0805]
R1  0R  [0805]
R2  0R  [0805]
R3  0R  [0805]
R4  0R  [0805]
R5  0R  [0805]
R6  0R  [0805]
R7  12K  [0805]
R8  0R  [0805]
R9  0R  [0805]
R10  0R  [0805]
RSense  0.05R/0.5W  [1206 - ohmite]
TP1  TEST_POINT_2  [TEST_POINT_2]  (no BOM)
TP2  TEST_POINT_2  [TEST_POINT_2]  (no BOM)
TP3  TEST_POINT_2  [TEST_POINT_2]  (no BOM)
TP4  TEST_POINT_2  [TEST_POINT_2]  (no BOM)
U1  TLV341AIDBVR  [SOT-23 6L]
U2  TLV341AIDBVR  [SOT-23 6L]
U3  MAX9934TAUA+  [MSOP-8]
U4  TLV341AIDBVR  [SOT-23 6L]

### Blocks framed on the sheet
Photodiode Current Sensing Circuit: C1 C3 C5 C32 C35 C56 R1-R6 R8-R10 TP1 TP2 TP4 U1 U2 U4
OBDH Consumption Current Circuit: C2 C4 C52 C53 J_V6 R7 RSense TP3 U3

### Ports
ADC_READINGS (harness ADC_READINGS), SUNSENSORS (harness SUNSENSORS), VCC_3V3, VCC_3V3_SOURCE

### Harnesses
ADC_READINGS: X_SUNSEN_ADC, Y_SUNSEN_ADC, Z_SUNSEN_ADC, OBDH_CURRENT_ADC
SUNSENSORS: SUNSEN_Z_ANODE, SUNSEN_Z_CATHODE, SUNSEN_Y_ANODE, SUNSEN_Y_CATHODE, SUNSEN_X_ANODE, SUNSEN_X_CATHODE

### Nets
3V3_C_Current_Circuit: C52.1 C53.1 J_V6.1 U3.1(Vcc) U3.6(CS)
3V3_Current_Sensing: C32.1 C35.1 C56.1 J_V1.1 U1.5(EN) U1.6(V+) U2.5(EN) U2.6(V+) U4.5(EN) U4.6(V+)
AGND: C2.2 C4.2 C52.2 C53.2 R7.1 U3.3(GND)
GND: C32.2 C35.2 C56.2 R1.2 R2.1 R4.2 R5.1 R8.2 R9.1 U1.2(Gnd) U2.2(Gnd) U4.2(Gnd)
VCC_3V3: J_V1.2 J_V6.2 RSense.2 ; port VCC_3V3
OBDH_CURRENT_ADC: C4.1 R7.2 TP3.1 U3.2(OUT) ; port ADC_READINGS.OBDH_CURRENT_ADC
SUNSEN_X_ANODE: R2.2 ; port SUNSENSORS.SUNSEN_X_ANODE
SUNSEN_X_CATHODE: C1.1 R3.2 U1.3(-IN) ; port SUNSENSORS.SUNSEN_X_CATHODE
SUNSEN_Y_ANODE: R5.2 ; port SUNSENSORS.SUNSEN_Y_ANODE
SUNSEN_Y_CATHODE: C3.1 R6.2 U2.3(-IN) ; port SUNSENSORS.SUNSEN_Y_CATHODE
SUNSEN_Z_ANODE: R9.2 ; port SUNSENSORS.SUNSEN_Z_ANODE
SUNSEN_Z_CATHODE: C5.1 R10.2 U4.3(-IN) ; port SUNSENSORS.SUNSEN_Z_CATHODE
VCC_3V3_SOURCE: C2.1 RSense.1 ; port VCC_3V3_SOURCE
Vsense2_N: RSense.4 U3.7(RS-)
Vsense2_P: RSense.3 U3.8(RS+)
X_SUNSEN_ADC: C1.2 R3.1 TP1.1 U1.4(OUT) ; port ADC_READINGS.X_SUNSEN_ADC
Y_SUNSEN_ADC: C3.2 R6.1 TP2.1 U2.4(OUT) ; port ADC_READINGS.Y_SUNSEN_ADC
Z_SUNSEN_ADC: C5.2 R10.1 TP4.1 U4.4(OUT) ; port ADC_READINGS.Z_SUNSEN_ADC
NetR1_1: R1.1 U1.1(+IN)
NetR4_1: R4.1 U2.1(+IN)
NetR8_1: R8.1 U4.1(+IN)

Not connected (* = marked no-connect by the designer): U3 4(N.C.) 5(N.C.)

### Layout directives
differential pair: Vsense2_N, Vsense2_P

### Notes on the sheet
- From Solar Panels
- To MCU
- Current Sense Amplifier:
  Rout = Voutmax/(Isensemax*Rsense*Gain)
  Rout = 3/(0.2*0.05*0.025)
  Rout = 12k
- Title
- Size:
- Date:
- A4
- Project:
- Time:
- FloripaSat
- Revision:
- Sheet
- of
- UFSC - SpaceLab
- University Campus - Trindade
- Dep. of Electrical Engineering - CTC
- Florianópolis, Santa Catarina, Brazil
- Drawn By:
- Model:
- CEP: 88040 - 900
- (in symbol Cap_Cer_X7R_0.1uF_25V_0805) .
- (in symbol Cap_Cer_X7R_18pF_50V_0805) .
- (in symbol Cap_Tant_SMD_10uF_10V_0805) +
- (in symbol TLV341AIDBVR) Sh; +; -

### Library data of the parts
C1 C3 C5 = Cap_Cer_X7R_18pF_50V_0805: CAP CER 18pF 50V 5% X7R 0805; Partnumber: CC0805JRNPO9BN180; NCM: 8532.24.10
C2 C4 C32 C35 C53 C56 = Cap_Cer_X7R_0.1uF_25V_0805: as C22 on sheet 3_MCU_Main; NCM: 8532.24.10
C52 = Cap_Tant_SMD_10uF_10V_0805: CAP Tantalum 10uF 10V 20% 0805; Partnumber: TPSP106M010R2000; NCM: 8532.21.11
J_V1 J_V6 R1-R6 R8-R10 = R0R_JUMPER_1/16W_0805: as J_V3 on sheet 3_MCU_Main; NCM: 8533.21.20
R7 = R1.65K_1%_1/10W_0805: RES 1.65K OHM 1/10W 0.1% 0805; Partnumber: PCF0805R-1K65BT1; NCM: 8533.21.20
RSense = R0.05R_0.5%_0.5W_1206: Current Sense Resistors - SMD 0.05ohm .5% 4 Terminal; Partnumber: LVK12R050DER; NCM: 8533.21.20
TP1-TP4 = TEST_POINT_2: Test point
U1 U2 U4 = TLV341AIDBVR: Partnumber: TLV341AIDBVR
U3 = MAX9934TAUA+: Partnumber: MAX9934TAUA+

## Sheet 5_Non_Volatile_Memory.SchDoc: Non Volatile Memory
size A4; DrawnBy: Sara V. Martinez; Engineer: Flight; Revision: V0.0; SheetNumber: 5; SheetTotal: 7
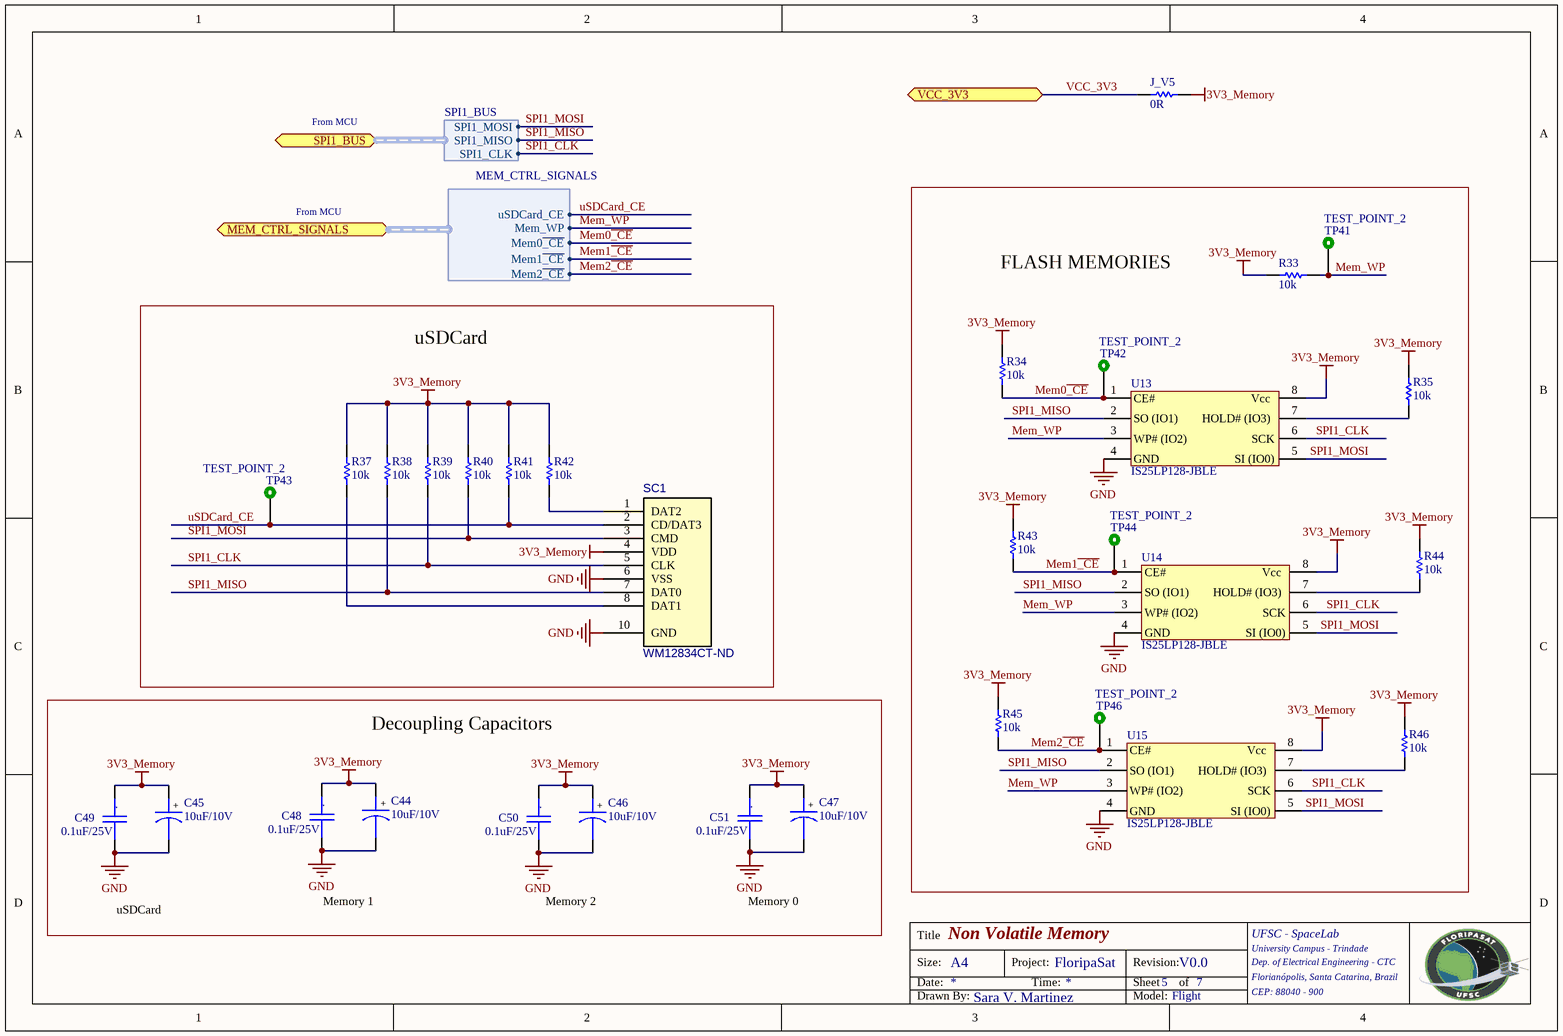
[diagram p5: 5_Non_Volatile_Memory.SchDoc]

### Parts
C44  10uF/10V  [CC0805_Tantalum]
C45  10uF/10V  [CC0805_Tantalum]
C46  10uF/10V  [CC0805_Tantalum]
C47  10uF/10V  [CC0805_Tantalum]
C48  0.1uF/25V  [CC0805]
C49  0.1uF/25V  [CC0805]
C50  0.1uF/25V  [CC0805]
C51  0.1uF/25V  [CC0805]
J_V5  0R  [0805]
R33  10k  [0805]
R34  10k  [0805]
R35  10k  [0805]
R37  10k  [0805]
R38  10k  [0805]
R39  10k  [0805]
R40  10k  [0805]
R41  10k  [0805]
R42  10k  [0805]
R43  10k  [0805]
R44  10k  [0805]
R45  10k  [0805]
R46  10k  [0805]
SC1  WM12834CT-ND  [uSD_Card]
TP41  TEST_POINT_2  [TEST_POINT_2]  (no BOM)
TP42  TEST_POINT_2  [TEST_POINT_2]  (no BOM)
TP43  TEST_POINT_2  [TEST_POINT_2]  (no BOM)
TP44  TEST_POINT_2  [TEST_POINT_2]  (no BOM)
TP46  TEST_POINT_2  [TEST_POINT_2]  (no BOM)
U13  IS25LP128-JBLE  [SOIC8]
U14  IS25LP128-JBLE  [SOIC8]
U15  IS25LP128-JBLE  [SOIC8]

### Blocks framed on the sheet
FLASH MEMORIES: R33-R35 R43-R46 TP41 TP42 TP44 TP46 U13-U15
uSDCard: R37-R42 SC1 TP43
Decoupling Capacitors: C44-C51

### Ports
MEM_CTRL_SIGNALS (harness MEM_CTRL_SIGNALS), SPI1_BUS (harness SPI1_BUS), VCC_3V3

### Harnesses
MEM_CTRL_SIGNALS: uSDCard_CE, Mem_WP, Mem0~{_CE}, Mem1~{_CE}, Mem2~{_CE}
SPI1_BUS: SPI1_CLK, SPI1_MISO, SPI1_MOSI

### Nets
3V3_Memory: C44.1 C45.1 C46.1 C47.1 C48.1 C49.1 C50.1 C51.1 J_V5.1 R33.2 R34.2 R35.2 R37.2 R38.2 R39.2 R40.2 R41.2 R42.2 R43.2 R44.2 R45.2 R46.2 SC1.4(VDD) U13.8(Vcc) U14.8(Vcc) U15.8(Vcc)
GND: C44.2 C45.2 C46.2 C47.2 C48.2 C49.2 C50.2 C51.2 SC1.6(VSS) SC1.10(GND) U13.4(GND) U14.4(GND) U15.4(GND)
VCC_3V3: J_V5.2 ; port VCC_3V3
Mem0~{_CE}: R34.1 TP42.1 U13.1(CE#) ; port MEM_CTRL_SIGNALS.Mem0~{_CE}
Mem1~{_CE}: R43.1 TP44.1 U14.1(CE#) ; port MEM_CTRL_SIGNALS.Mem1~{_CE}
Mem2~{_CE}: R45.1 TP46.1 U15.1(CE#) ; port MEM_CTRL_SIGNALS.Mem2~{_CE}
Mem_WP: R33.1 TP41.1 U13.3(WP#_(IO2)) U14.3(WP#_(IO2)) U15.3(WP#_(IO2)) ; port MEM_CTRL_SIGNALS.Mem_WP
SPI1_CLK: R39.1 SC1.5(CLK) U13.6(SCK) U14.6(SCK) U15.6(SCK) ; port SPI1_BUS.SPI1_CLK
SPI1_MISO: R38.1 SC1.7(DAT0) U13.2(SO_(IO1)) U14.2(SO_(IO1)) U15.2(SO_(IO1)) ; port SPI1_BUS.SPI1_MISO
SPI1_MOSI: R40.1 SC1.3(CMD) U13.5(SI_(IO0)) U14.5(SI_(IO0)) U15.5(SI_(IO0)) ; port SPI1_BUS.SPI1_MOSI
uSDCard_CE: R41.1 SC1.2(CD/DAT3) TP43.1 ; port MEM_CTRL_SIGNALS.uSDCard_CE
NetR35_1: R35.1 U13.7(HOLD#_(IO3))
NetR37_1: R37.1 SC1.8(DAT1)
NetR42_1: R42.1 SC1.1(DAT2)
NetR44_1: R44.1 U14.7(HOLD#_(IO3))
NetR46_1: R46.1 U15.7(HOLD#_(IO3))

### Notes on the sheet
- From MCU
- uSDCard
- Memory 1
- Memory 2
- Memory 0
- Title
- Size:
- Date:
- A4
- Project:
- Time:
- FloripaSat
- Revision:
- Sheet
- of
- UFSC - SpaceLab
- University Campus - Trindade
- Dep. of Electrical Engineering - CTC
- Florianópolis, Santa Catarina, Brazil
- Drawn By:
- Model:
- CEP: 88040 - 900
- (in symbol Cap_Cer_X7R_0.1uF_25V_0805) .
- (in symbol Cap_Tant_SMD_10uF_10V_0805) +

### Library data of the parts
C44-C47 = Cap_Tant_SMD_10uF_10V_0805: as C52 on sheet 7_Current_Sensing; NCM: 8532.21.11
C48-C51 = Cap_Cer_X7R_0.1uF_25V_0805: as C22 on sheet 3_MCU_Main; NCM: 8532.24.10
J_V5 = R0R_JUMPER_1/16W_0805: as J_V3 on sheet 3_MCU_Main; NCM: 8533.21.20
R33-R35 R37-R46 = R10k_1%_1/8W_0805: as R20 on sheet 3_MCU_Main; NCM: 8533.21.20
SC1 = MicroSD_Card_Connector: MicroSD CARD Connector; Partnumber: WM12834CT-ND; NCM: 8536.90.40
TP41-TP44 TP46 = TEST_POINT_2: Test point
U13-U15 = IS25LP128-JBLE: IC FLASH 128MBIT 133MHZ 8SOIC; Partnumber: IS25LP128-JBLE

## Sheet 6_Magnetorquer_Drivers.SchDoc: Magnetorquer Drivers
size A4; DrawnBy: Sara V. Martinez; Engineer: Flight; Revision: V0.0; SheetNumber: 6; SheetTotal: 7
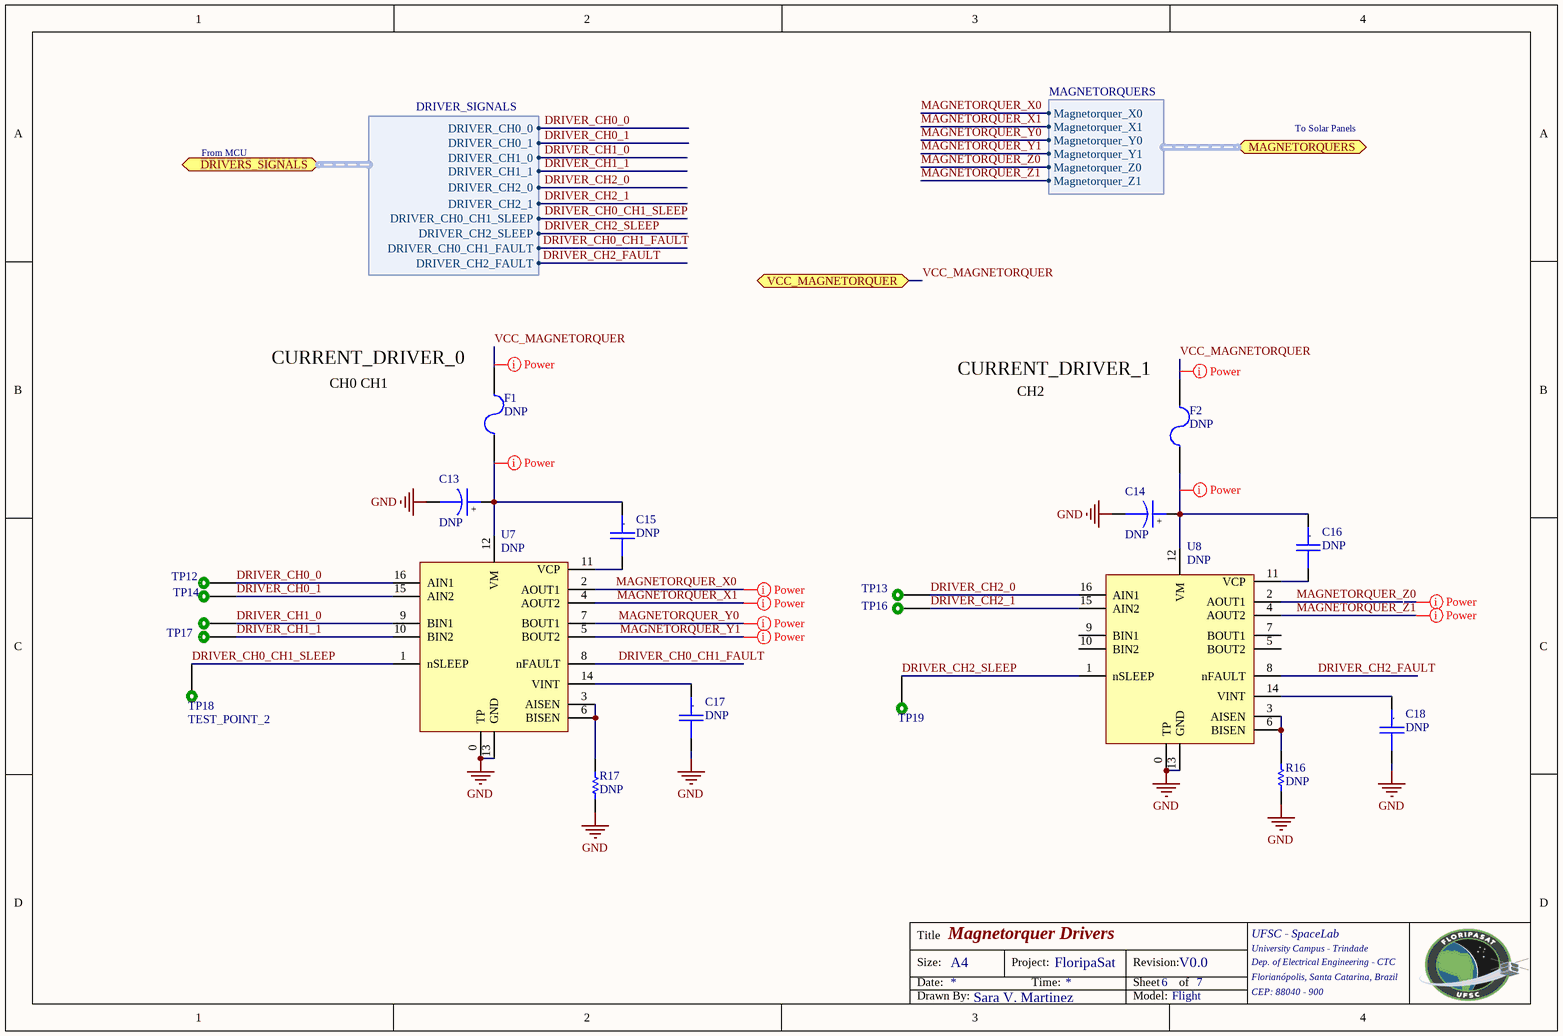
[diagram p6: 6_Magnetorquer_Drivers.SchDoc]

### Parts
C13  DNP  [CC0805_Tantalum]
C14  DNP  [CC0805_Tantalum]
C15  DNP  [CC0805]
C16  DNP  [CC0805]
C17  DNP  [CC0805]
C18  DNP  [CC0805]
F1  DNP  [1206]
F2  DNP  [1206]
R16  DNP  [0805]
R17  DNP  [0805]
TP12  TEST_POINT_2  [TEST_POINT_2]  (value not drawn)  (no BOM)
TP13  TEST_POINT_2  [TEST_POINT_2]  (value not drawn)  (no BOM)
TP14  TEST_POINT_2  [TEST_POINT_2]  (value not drawn)  (no BOM)
TP15  TEST_POINT_2  [TEST_POINT_2]  (value not drawn)  (no BOM)
TP16  TEST_POINT_2  [TEST_POINT_2]  (value not drawn)  (no BOM)
TP17  TEST_POINT_2  [TEST_POINT_2]  (value not drawn)  (no BOM)
TP18  TEST_POINT_2  [TEST_POINT_2]  (no BOM)
TP19  TEST_POINT_2  [TEST_POINT_2]  (value not drawn)  (no BOM)
U7  DNP  [16TTSSOP]
U8  DNP  [16TTSSOP]

### Ports
DRIVERS_SIGNALS (harness DRIVER_SIGNALS), MAGNETORQUERS (harness MAGNETORQUERS), VCC_MAGNETORQUER

### Harnesses
MAGNETORQUERS: Magnetorquer_X0, Magnetorquer_X1, Magnetorquer_Y0, Magnetorquer_Y1, Magnetorquer_Z0, Magnetorquer_Z1
DRIVER_SIGNALS: DRIVER_CH1_1, DRIVER_CH1_0, DRIVER_CH0_1, DRIVER_CH0_0, DRIVER_CH2_0, DRIVER_CH2_1, DRIVER_CH0_CH1_SLEEP, DRIVER_CH2_SLEEP, DRIVER_CH0_CH1_FAULT, DRIVER_CH2_FAULT

### Nets
GND: C13.2 C14.2 C17.2 C18.2 R16.1 R17.1 U7.0(TP) U7.13(GND) U8.0(TP) U8.13(GND)
DRIVER_CH0_0: TP12.1 U7.16(AIN1) ; port DRIVERS_SIGNALS.DRIVER_CH0_0
DRIVER_CH0_1: TP14.1 U7.15(AIN2) ; port DRIVERS_SIGNALS.DRIVER_CH0_1
DRIVER_CH0_CH1_FAULT: U7.8(nFAULT) ; port DRIVERS_SIGNALS.DRIVER_CH0_CH1_FAULT
DRIVER_CH0_CH1_SLEEP: TP18.1 U7.1(nSLEEP) ; port DRIVERS_SIGNALS.DRIVER_CH0_CH1_SLEEP
DRIVER_CH1_0: TP15.1 U7.9(BIN1) ; port DRIVERS_SIGNALS.DRIVER_CH1_0
DRIVER_CH1_1: TP17.1 U7.10(BIN2) ; port DRIVERS_SIGNALS.DRIVER_CH1_1
DRIVER_CH2_0: TP13.1 U8.16(AIN1) ; port DRIVERS_SIGNALS.DRIVER_CH2_0
DRIVER_CH2_1: TP16.1 U8.15(AIN2) ; port DRIVERS_SIGNALS.DRIVER_CH2_1
DRIVER_CH2_FAULT: U8.8(nFAULT) ; port DRIVERS_SIGNALS.DRIVER_CH2_FAULT
DRIVER_CH2_SLEEP: TP19.1 U8.1(nSLEEP) ; port DRIVERS_SIGNALS.DRIVER_CH2_SLEEP
MAGNETORQUER_X0: U7.2(AOUT1) ; port MAGNETORQUERS.Magnetorquer_X0
MAGNETORQUER_X1: U7.4(AOUT2) ; port MAGNETORQUERS.Magnetorquer_X1
MAGNETORQUER_Y0: U7.7(BOUT1) ; port MAGNETORQUERS.Magnetorquer_Y0
MAGNETORQUER_Y1: U7.5(BOUT2) ; port MAGNETORQUERS.Magnetorquer_Y1
MAGNETORQUER_Z0: U8.2(AOUT1) ; port MAGNETORQUERS.Magnetorquer_Z0
MAGNETORQUER_Z1: U8.4(AOUT2) ; port MAGNETORQUERS.Magnetorquer_Z1
VCC_MAGNETORQUER: F1.2 F2.2 ; port VCC_MAGNETORQUER
NetC13_1: C13.1 C15.1 F1.1 U7.12(VM)
NetC14_1: C14.1 C16.1 F2.1 U8.12(VM)
NetC15_2: C15.2 U7.11(VCP)
NetC16_2: C16.2 U8.11(VCP)
NetC17_1: C17.1 U7.14(VINT)
NetC18_1: C18.1 U8.14(VINT)
NetR16_2: R16.2 U8.3(AISEN) U8.6(BISEN)
NetR17_2: R17.2 U7.3(AISEN) U7.6(BISEN)

Not connected (* = marked no-connect by the designer): U8 5(BOUT2) 7(BOUT1) 9(BIN1) 10(BIN2)

### Layout directives
net class Power: (no net found under the mark), MAGNETORQUER_X0, MAGNETORQUER_X1, MAGNETORQUER_Y0, MAGNETORQUER_Y1, MAGNETORQUER_Z1, NetC13_1, NetC14_1, VCC_MAGNETORQUER

### Notes on the sheet
- From MCU
- To Solar Panels
- CURRENT_DRIVER_0
- CURRENT_DRIVER_1
- CH0 CH1
- CH2
- Title
- Size:
- Date:
- A4
- Project:
- Time:
- FloripaSat
- Revision:
- Sheet
- of
- UFSC - SpaceLab
- University Campus - Trindade
- Dep. of Electrical Engineering - CTC
- Florianópolis, Santa Catarina, Brazil
- Drawn By:
- Model:
- CEP: 88040 - 900
- (in symbol Cap_Cer_X7R_0.01uF_50V_0805) .
- (in symbol Cap_Cer_X7R_2.2uF_16V_0805) .
- (in symbol Cap_Tant_SMD_10uF_10V_0805) +

### Library data of the parts
C13 C14 = Cap_Tant_SMD_10uF_10V_0805: as C52 on sheet 7_Current_Sensing; NCM: 8532.21.11
C15 C16 = Cap_Cer_X7R_0.01uF_50V_0805: CAP CER 0.01uF 50V 10% X7R 0805; Partnumber: CL21B103KAANNNC; NCM: 8532.24.10
C17 C18 = Cap_Cer_X7R_2.2uF_16V_0805: CAP CER 2.2uF 16V 0805; Partnumber: C2012X7R1C225K125AB; NCM: 8532.24.10
F1 F2 = Fuse: Surface Mount Fuses SMD FA 4A; PartNumber: 0437.375WR; Published: 8-Jun-2000; LatestRevisionDate: 17-Jul-2002; LatestRevisionNote: Re-released for DXP Platform.; PackageReference: PIN-W2/E2.8; Publisher: Altium Limited; PackageDescription: Thru-Hole; 2 Leads
R16 = R0.015R_1%_0.5W_0805: RES 0.2 OHM -0.2W 1% 0805; Partnumber: RL1220S-R20-F; NCM: 8533.21.20
R17 = R0.015R_1%_0.5W_0805: RES 0.2 OHM - 0.2W 1% 0805; Partnumber: RL1220S-R20-F; NCM: 8533.21.20
TP12-TP19 = TEST_POINT_2: Test point
U7 U8 = DRV8833PWPR: Partnumber: DRV8833PWPR

## Sheet 4_IMU.SchDoc: IMUs
size A4; DrawnBy: Sara V. Martinez; Engineer: Flight; Revision: V0.0; SheetNumber: 4; SheetTotal: 7
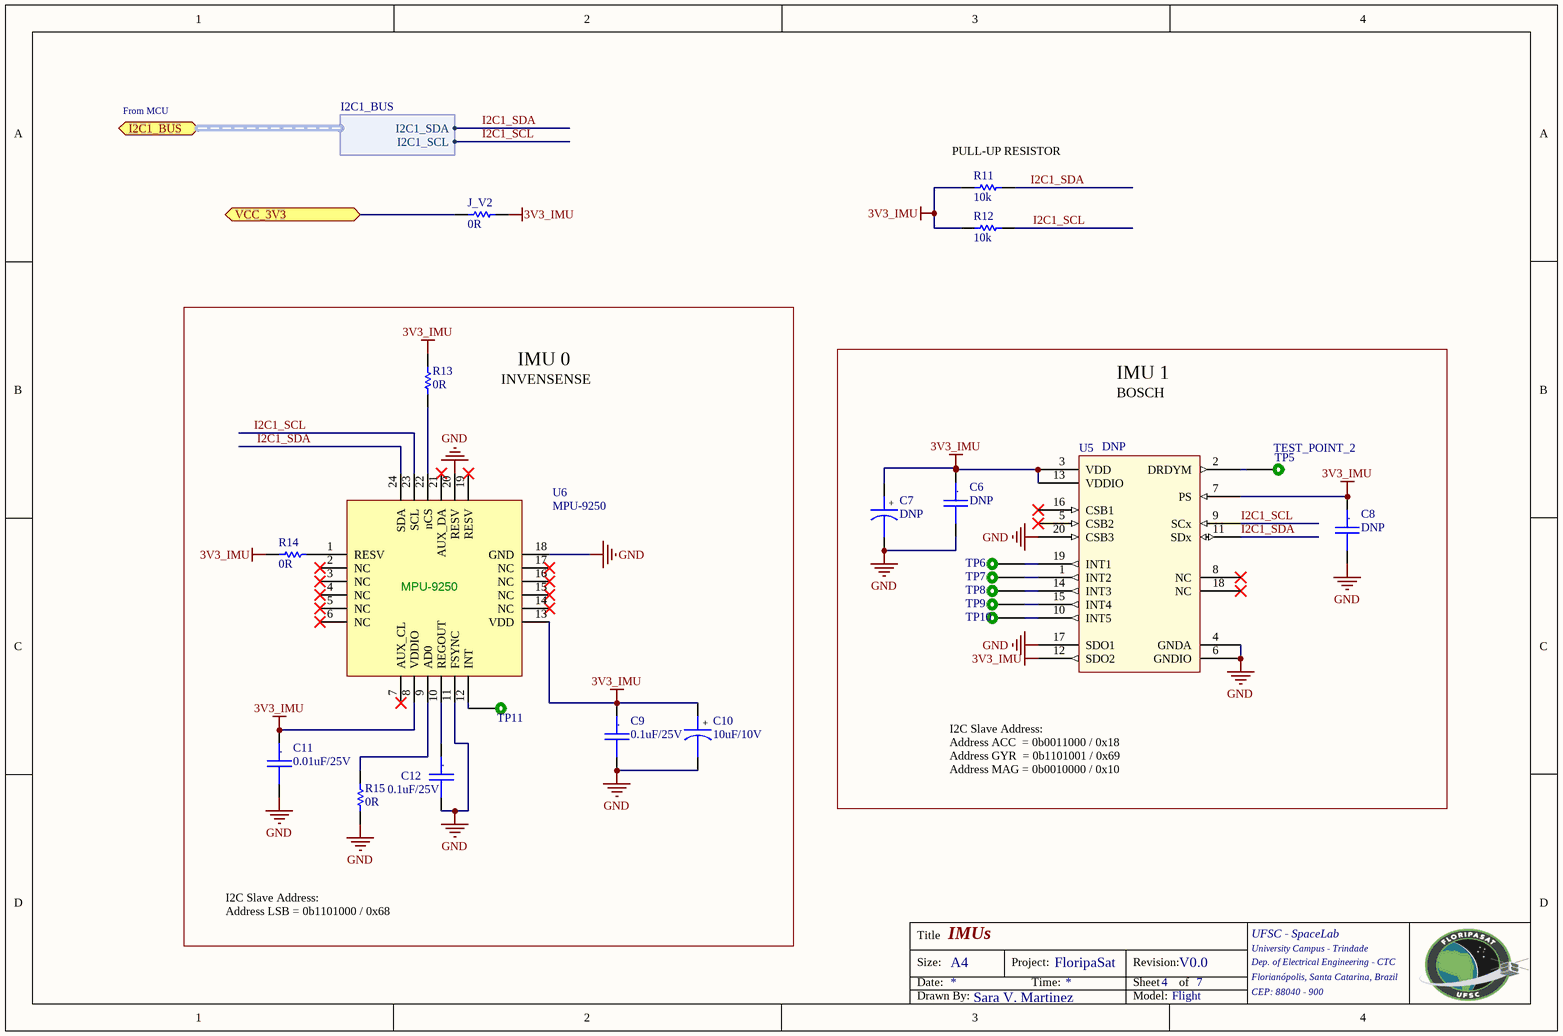
[diagram p7: 4_IMU.SchDoc]

### Parts
C6  DNP  [CC0805]
C7  DNP  [CC0805_Tantalum]
C8  DNP  [CC0805]
C9  0.1uF/25V  [CC0805]
C10  10uF/10V  [CC0805_Tantalum]
C11  0.01uF/25V  [CC0805]
C12  0.1uF/25V  [CC0805]
J_V2  0R  [0805]
R11  10k  [0805]
R12  10k  [0805]
R13  0R  [0805]
R14  0R  [0805]
R15  0R  [0805]
TP5  TEST_POINT_2  [TEST_POINT_2]  (no BOM)
TP6  TEST_POINT_2  [TEST_POINT_2]  (value not drawn)  (no BOM)
TP7  TEST_POINT_2  [TEST_POINT_2]  (value not drawn)  (no BOM)
TP8  TEST_POINT_2  [TEST_POINT_2]  (value not drawn)  (no BOM)
TP9  TEST_POINT_2  [TEST_POINT_2]  (value not drawn)  (no BOM)
TP10  TEST_POINT_2  [TEST_POINT_2]  (value not drawn)  (no BOM)
TP11  TEST_POINT_2  [TEST_POINT_2]  (value not drawn)  (no BOM)
U5  DNP  [LGA20]
U6  MPU-9250  [QFN24P300X300X105-25N]

### Blocks framed on the sheet
IMU 0: C9-C12 R13-R15 TP11 U6
IMU 1: C6-C8 TP5-TP10 U5

### Ports
I2C1_BUS (harness I2C1_BUS), VCC_3V3

### Harnesses
I2C1_BUS: I2C1_SCL, I2C1_SDA

### Nets
3V3_IMU: C6.1 C7.1 C8.1 C9.1 C10.1 C11.1 J_V2.1 R11.2 R12.2 R13.2 R14.2 U5.3(VDD) U5.7(PS) U5.12(SDO2) U5.13(VDDIO) U6.8(VDDIO) U6.13(VDD)
GND: C6.2 C7.2 C8.2 C9.2 C10.2 C11.2 C12.2 R15.2 U5.4(GNDA) U5.6(GNDIO) U5.17(SDO1) U5.20(CSB3) U6.11(FSYNC) U6.18(GND) U6.20(RESV)
VCC_3V3: J_V2.2 ; port VCC_3V3
I2C1_SCL: R12.1 U5.9(SCx) U6.23(SCL) ; port I2C1_BUS.I2C1_SCL
I2C1_SDA: R11.1 U5.11(SDx) U6.24(SDA) ; port I2C1_BUS.I2C1_SDA
NetC12_1: C12.1 U6.10(REGOUT)
NetR13_1: R13.1 U6.22(nCS)
NetR14_1: R14.1 U6.1(RESV)
NetR15_1: R15.1 U6.9(AD0)
NetTP5_1: TP5.1 U5.2(DRDYM)
NetTP6_1: TP6.1 U5.19(INT1)
NetTP7_1: TP7.1 U5.1(INT2)
NetTP8_1: TP8.1 U5.14(INT3)
NetTP9_1: TP9.1 U5.15(INT4)
NetTP10_1: TP10.1 U5.10(INT5)
NetTP11_1: TP11.1 U6.12(INT)

Not connected (* = marked no-connect by the designer): U5 5(CSB2)* 8(NC)* 16(CSB1)* 18(NC)*; U6 2(NC)* 3(NC)* 4(NC)* 5(NC)* 6(NC)* 7(AUX_CL)* 14(NC)* 15(NC)* 16(NC)* 17(NC)* 19(RESV)* 21(AUX_DA)*

### Notes on the sheet
- From MCU
- (near R11) PULL-UP RESISTOR
- INVENSENSE
- BOSCH
- I2C Slave Address:
  Address ACC  = 0b0011000 / 0x18
  Address GYR  = 0b1101001 / 0x69
  Address MAG = 0b0010000 / 0x10
- I2C Slave Address:
  Address LSB = 0b1101000 / 0x68
- Title
- Size:
- Date:
- A4
- Project:
- Time:
- FloripaSat
- Revision:
- Sheet
- of
- UFSC - SpaceLab
- University Campus - Trindade
- Dep. of Electrical Engineering - CTC
- Florianópolis, Santa Catarina, Brazil
- Drawn By:
- Model:
- CEP: 88040 - 900
- (in symbol Cap_Cer_X7R_0.1uF_25V_0805) .
- (in symbol Cap_Cer_X7R_0.01uF_50V_0805) .
- (in symbol Cap_Tant_SMD_10uF_10V_0805) +

### Library data of the parts
C6 C8 C9 C12 = Cap_Cer_X7R_0.1uF_25V_0805: as C22 on sheet 3_MCU_Main; NCM: 8532.24.10
C7 C10 = Cap_Tant_SMD_10uF_10V_0805: as C52 on sheet 7_Current_Sensing; NCM: 8532.21.11
C11 = Cap_Cer_X7R_0.01uF_50V_0805: as C39 on sheet 3_MCU_Main; NCM: 8532.24.10
J_V2 R13-R15 = R0R_JUMPER_1/16W_0805: as J_V3 on sheet 3_MCU_Main; NCM: 8533.21.20
R11 R12 = R10k_1%_1/8W_0805: as R20 on sheet 3_MCU_Main; NCM: 8533.21.20
TP5-TP11 = TEST_POINT_2: Test point
U5 = BMX055
U6 = MPU9250: SMD Gyroscope/Accelerometer/Magnetometer Sensor; 9-AXIS; Partnumber: MPU-9250

## Nets that join several sheets
AGND: 3_MCU_Main (16 pins), 7_Current_Sensing (6 pins)
GND: 1_Interface (14 pins), 3_MCU_Main (28 pins), 7_Current_Sensing (12 pins), 5_Non_Volatile_Memory (13 pins), 6_Magnetorquer_Drivers (10 pins), 4_IMU (15 pins)
VCC_3V3: 1_Interface (-X.2 -Y.2 -Z.2), 3_MCU_Main (26 pins), 7_Current_Sensing (J_V1.2 J_V6.2 RSense.2), 5_Non_Volatile_Memory (J_V5.2), 4_IMU (J_V2.2)
VCC_3V3_Deployment: 1_Interface (P8.1 P8.2 U16.H2-35 U16.H2-36), 3_MCU_Main (C54.1 C55.1 R47.2)
ANTENNA_DEBUG: 1_Interface (P8.5), 3_MCU_Main (U9.67)
DRIVER_CH0_0: 3_MCU_Main (U9.44), 6_Magnetorquer_Drivers (TP12.1 U7.16)
DRIVER_CH0_1: 3_MCU_Main (U9.45), 6_Magnetorquer_Drivers (TP14.1 U7.15)
DRIVER_CH0_CH1_FAULT: 3_MCU_Main (U9.68), 6_Magnetorquer_Drivers (U7.8)
DRIVER_CH0_CH1_SLEEP: 3_MCU_Main (U9.42), 6_Magnetorquer_Drivers (TP18.1 U7.1)
DRIVER_CH1_0: 3_MCU_Main (U9.46), 6_Magnetorquer_Drivers (TP15.1 U7.9)
DRIVER_CH1_1: 3_MCU_Main (U9.47), 6_Magnetorquer_Drivers (TP17.1 U7.10)
DRIVER_CH2_0: 3_MCU_Main (U9.48), 6_Magnetorquer_Drivers (TP13.1 U8.16)
DRIVER_CH2_1: 3_MCU_Main (U9.49), 6_Magnetorquer_Drivers (TP16.1 U8.15)
DRIVER_CH2_FAULT: 3_MCU_Main (U9.69), 6_Magnetorquer_Drivers (U8.8)
DRIVER_CH2_SLEEP: 3_MCU_Main (U9.43), 6_Magnetorquer_Drivers (TP19.1 U8.1)
GYRO_X_CSn: 1_Interface (-X.8), 3_MCU_Main (R24.1 U9.54)
GYRO_Y_CSn: 1_Interface (-Y.8), 3_MCU_Main (R29.1 U9.52)
GYRO_Z_CSn: 1_Interface (-Z.8), 3_MCU_Main (R31.1 U9.50)
I2C0_SCL: 1_Interface (U16.H1-43), 3_MCU_Main (R22.1 U9.19)
I2C0_SDA: 1_Interface (U16.H1-41), 3_MCU_Main (R23.1 U9.18)
I2C1_SCL: 1_Interface (P5.2), 3_MCU_Main (U9.66), 4_IMU (R12.1 U5.9 U6.23)
I2C1_SDA: 1_Interface (P5.1), 3_MCU_Main (U9.65), 4_IMU (R11.1 U5.11 U6.24)
I2C2_SCL: 1_Interface (P8.4), 3_MCU_Main (R20.1 U9.74)
I2C2_SDA: 1_Interface (P8.3), 3_MCU_Main (R21.1 U9.73)
JTAG_TCK: 1_Interface (P2.3), 3_MCU_Main (U9.95)
JTAG_TDO: 1_Interface (P2.2), 3_MCU_Main (C20.1 R18.1 R48.1 U9.96)
MAGNETORQUER_X0: 1_Interface (-X.12), 6_Magnetorquer_Drivers (U7.2)
MAGNETORQUER_X1: 1_Interface (-X.11), 6_Magnetorquer_Drivers (U7.4)
MAGNETORQUER_Y0: 1_Interface (-Y.12), 6_Magnetorquer_Drivers (U7.7)
MAGNETORQUER_Y1: 1_Interface (-Y.11), 6_Magnetorquer_Drivers (U7.5)
MAGNETORQUER_Z0: 1_Interface (-Z.12), 6_Magnetorquer_Drivers (U8.2)
MAGNETORQUER_Z1: 1_Interface (-Z.11), 6_Magnetorquer_Drivers (U8.4)
Mem0~{_CE}: 3_MCU_Main (U9.6), 5_Non_Volatile_Memory (R34.1 TP42.1 U13.1)
Mem1~{_CE}: 3_MCU_Main (U9.7), 5_Non_Volatile_Memory (R43.1 TP44.1 U14.1)
Mem2~{_CE}: 3_MCU_Main (U9.8), 5_Non_Volatile_Memory (R45.1 TP46.1 U15.1)
Mem_WP: 3_MCU_Main (U9.5), 5_Non_Volatile_Memory (5 pins)
OBDH_CURRENT_ADC: 3_MCU_Main (U9.100), 7_Current_Sensing (C4.1 R7.2 TP3.1 U3.2)
PAYLOAD_0_EN: 1_Interface (U16.H1-18), 3_MCU_Main (U9.16)
PAYLOAD_1_EN: 1_Interface (U16.H1-20), 3_MCU_Main (U9.28)
SPI0_CLK: 1_Interface (U16.H1-35), 3_MCU_Main (U9.17)
SPI0_CSn: 1_Interface (U16.H1-40), 3_MCU_Main (U9.20)
SPI0_MISO: 1_Interface (U16.H1-37), 3_MCU_Main (U9.22)
SPI0_MOSI: 1_Interface (U16.H1-39), 3_MCU_Main (U9.21)
SPI1_CLK: 1_Interface (-X.4 -Y.4 -Z.4 P4.1), 3_MCU_Main (U9.59), 5_Non_Volatile_Memory (5 pins)
SPI1_MISO: 1_Interface (-X.3 -Y.3 -Z.1 P4.2), 3_MCU_Main (C24.1 R19.1 U9.61), 5_Non_Volatile_Memory (5 pins)
SPI1_MOSI: 1_Interface (-X.7 -Y.7 -Z.7 P4.3), 3_MCU_Main (U9.60), 5_Non_Volatile_Memory (5 pins)
SUNSEN_X_ANODE: 1_Interface (-X.6), 7_Current_Sensing (R2.2)
SUNSEN_X_CATHODE: 1_Interface (-X.5), 7_Current_Sensing (C1.1 R3.2 U1.3)
SUNSEN_Y_ANODE: 1_Interface (-Y.6), 7_Current_Sensing (R5.2)
SUNSEN_Y_CATHODE: 1_Interface (-Y.5), 7_Current_Sensing (C3.1 R6.2 U2.3)
SUNSEN_Z_ANODE: 1_Interface (-Z.6), 7_Current_Sensing (R9.2)
SUNSEN_Z_CATHODE: 1_Interface (-Z.5), 7_Current_Sensing (C5.1 R10.2 U4.3)
TEMP_X_CSn: 1_Interface (-X.1), 3_MCU_Main (R25.1 U9.55)
TEMP_Y_CSn: 1_Interface (-Y.1), 3_MCU_Main (R30.1 U9.53)
TEMP_Z_CSn: 1_Interface (-Z.3), 3_MCU_Main (R32.1 U9.51)
TTC_3V3_PA_EN: 1_Interface (U16.H1-12), 3_MCU_Main (U9.35)
TTC_CTRL_RF_SWT_RX: 1_Interface (U16.H1-5), 3_MCU_Main (U9.41)
TTC_CTRL_RF_SWT_TX: 1_Interface (U16.H1-6), 3_MCU_Main (U9.40)
TTC_GPIO0_MAIN: 1_Interface (U16.H1-7), 3_MCU_Main (U9.39)
TTC_GPIO1_MAIN: 1_Interface (U16.H1-8), 3_MCU_Main (U9.38)
TTC_GPIO2_MAIN: 1_Interface (U16.H1-9), 3_MCU_Main (U9.37)
TTC_RESETn_MAIN: 1_Interface (U16.H1-11), 3_MCU_Main (U9.36)
UART0_RX: 1_Interface (P2.5 P3.2), 3_MCU_Main (U9.71)
UART0_TX: 1_Interface (P2.4 P3.1), 3_MCU_Main (U9.70)
uC_BEACON_0: 1_Interface (U16.H2-12), 3_MCU_Main (U9.32)
uC_BEACON_1: 1_Interface (U16.H2-11), 3_MCU_Main (U9.33)
uC_BEACON_2: 1_Interface (U16.H2-14), 3_MCU_Main (U9.23)
uC_BEACON_3: 1_Interface (U16.H2-13), 3_MCU_Main (U9.24)
uSDCard_CE: 3_MCU_Main (U9.56), 5_Non_Volatile_Memory (R41.1 SC1.2 TP43.1)
VCC_3V3_SOURCE: 1_Interface (P2.1 U16.H1-45 U16.H1-46), 7_Current_Sensing (C2.1 RSense.1)
VCC_5V_EN: 1_Interface (U16.H1-13), 3_MCU_Main (U9.34)
VCC_MAGNETORQUER: 1_Interface (U16.H2-45 U16.H2-46), 6_Magnetorquer_Drivers (F1.2 F2.2)
WDI_EXT: 1_Interface (P3.3), 3_MCU_Main (U9.72 U10.4)
X_SUNSEN_ADC: 3_MCU_Main (U9.97), 7_Current_Sensing (C1.2 R3.1 TP1.1 U1.4)
Y_SUNSEN_ADC: 3_MCU_Main (U9.98), 7_Current_Sensing (C3.2 R6.1 TP2.1 U2.4)
Z_SUNSEN_ADC: 3_MCU_Main (U9.99), 7_Current_Sensing (C5.2 R10.1 TP4.1 U4.4)